# EAGLE schematic sweetbox (EAGLE 5.03)
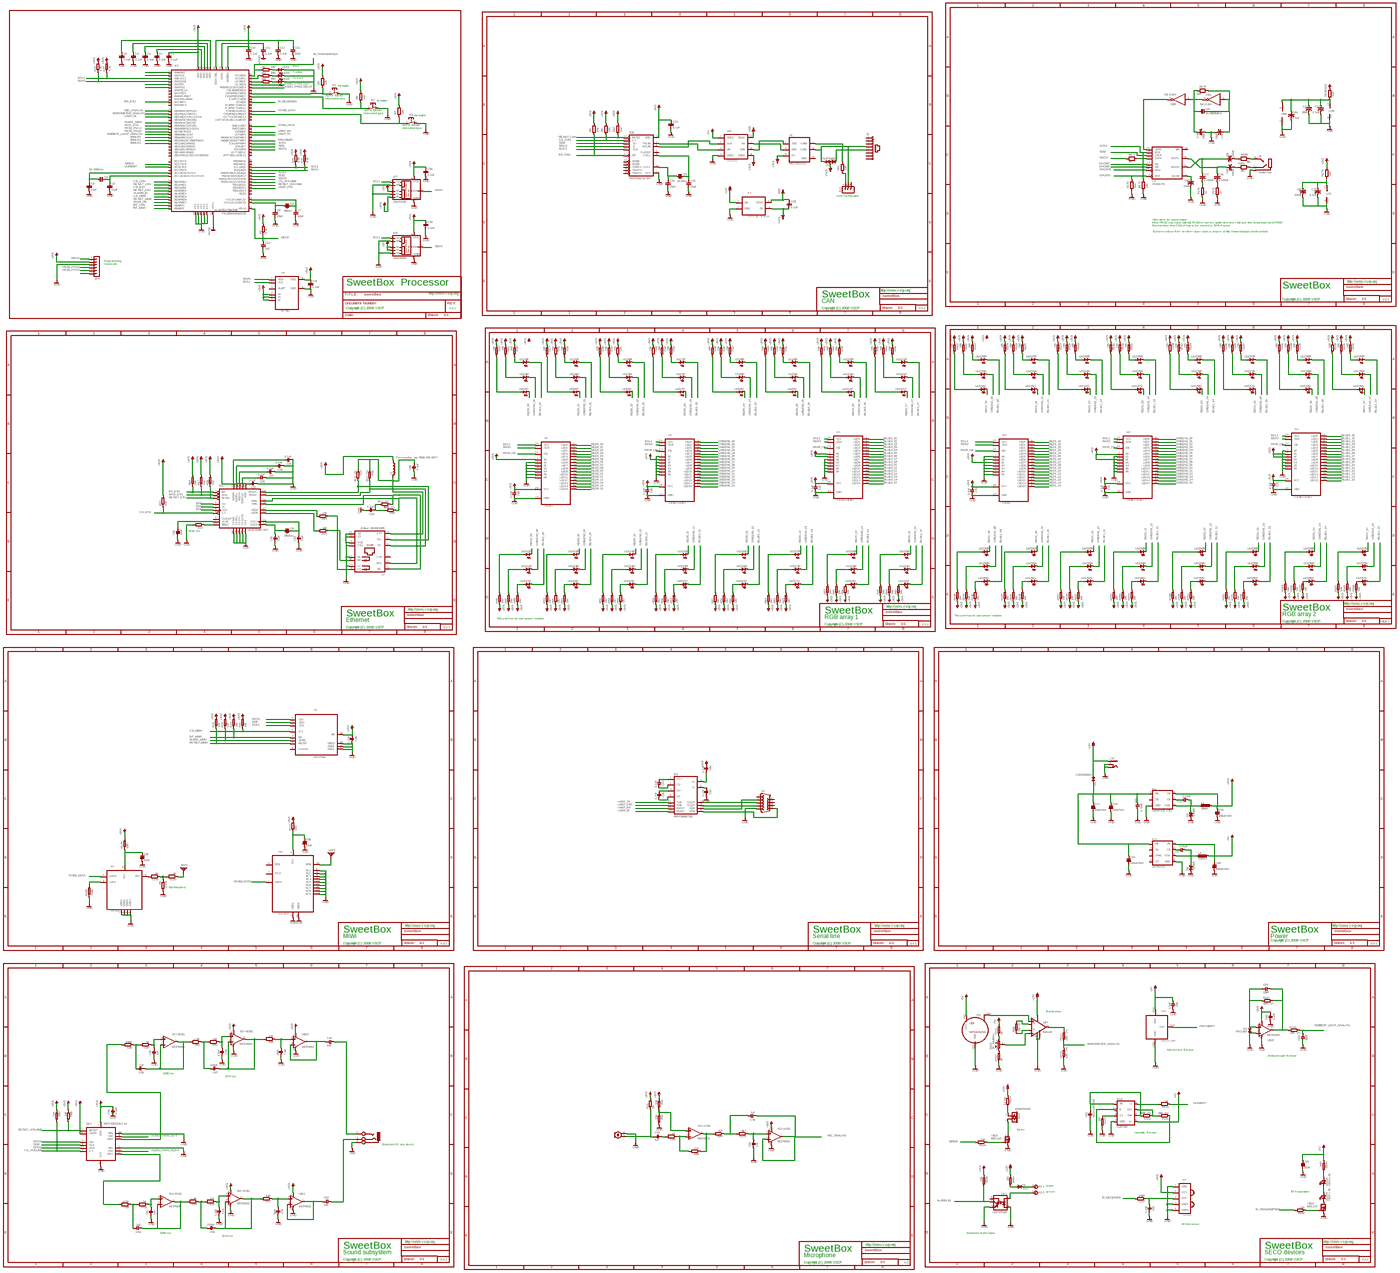
[diagram p0: schematic, sheet 1, overview]
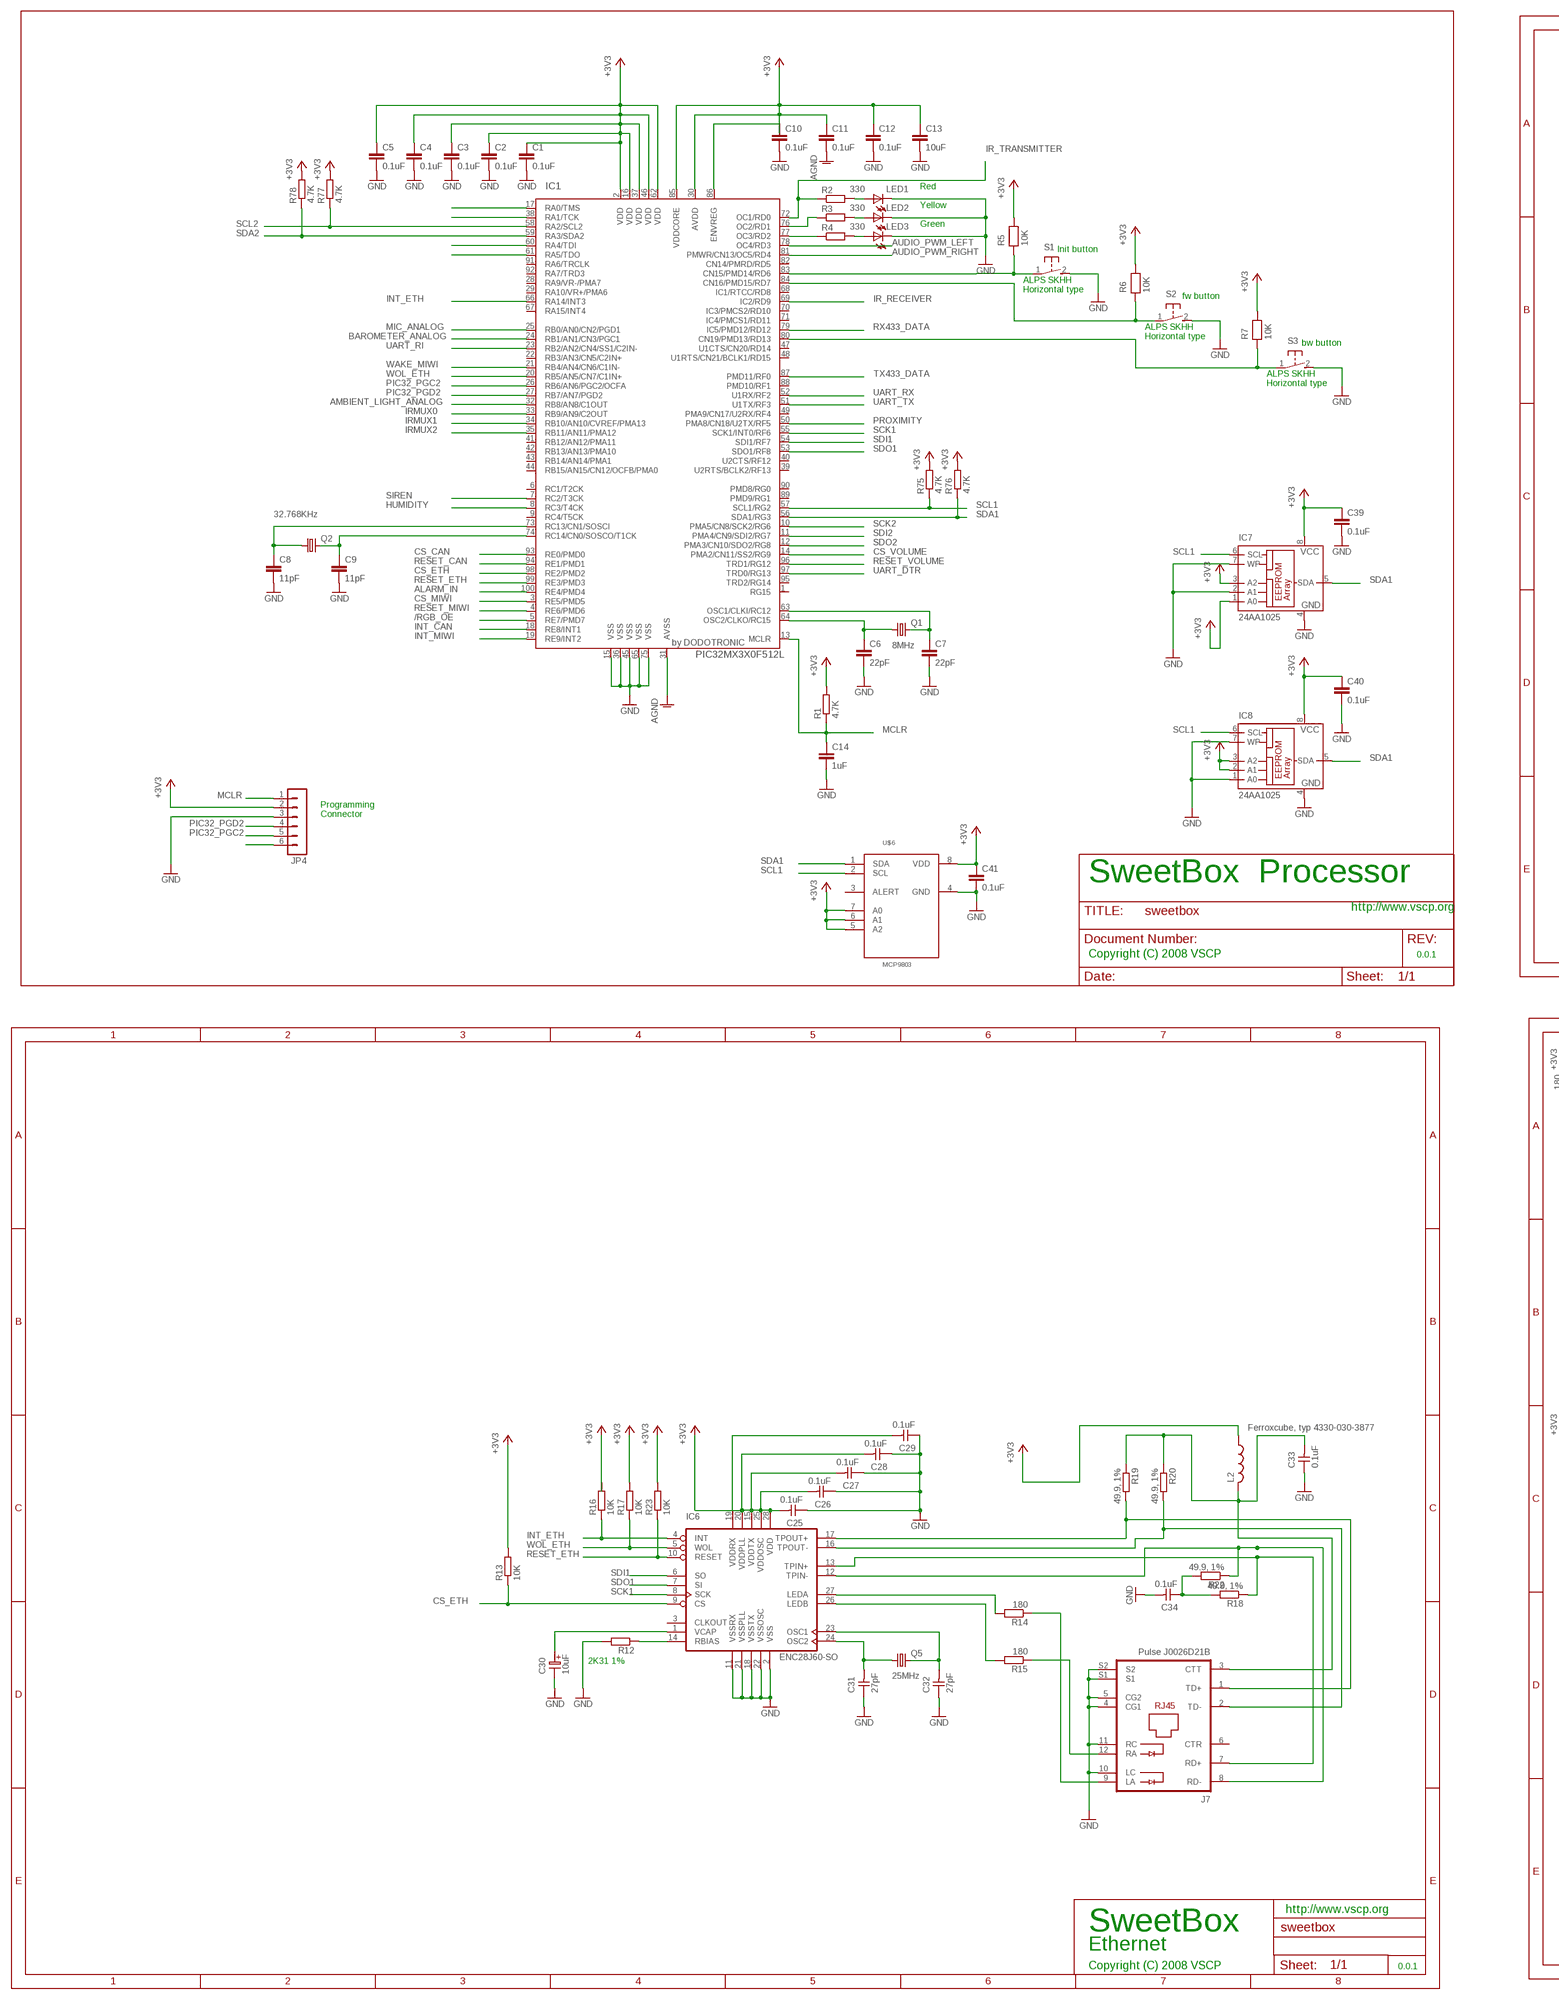
[diagram p1: schematic, sheet 1, part 1 of 6]
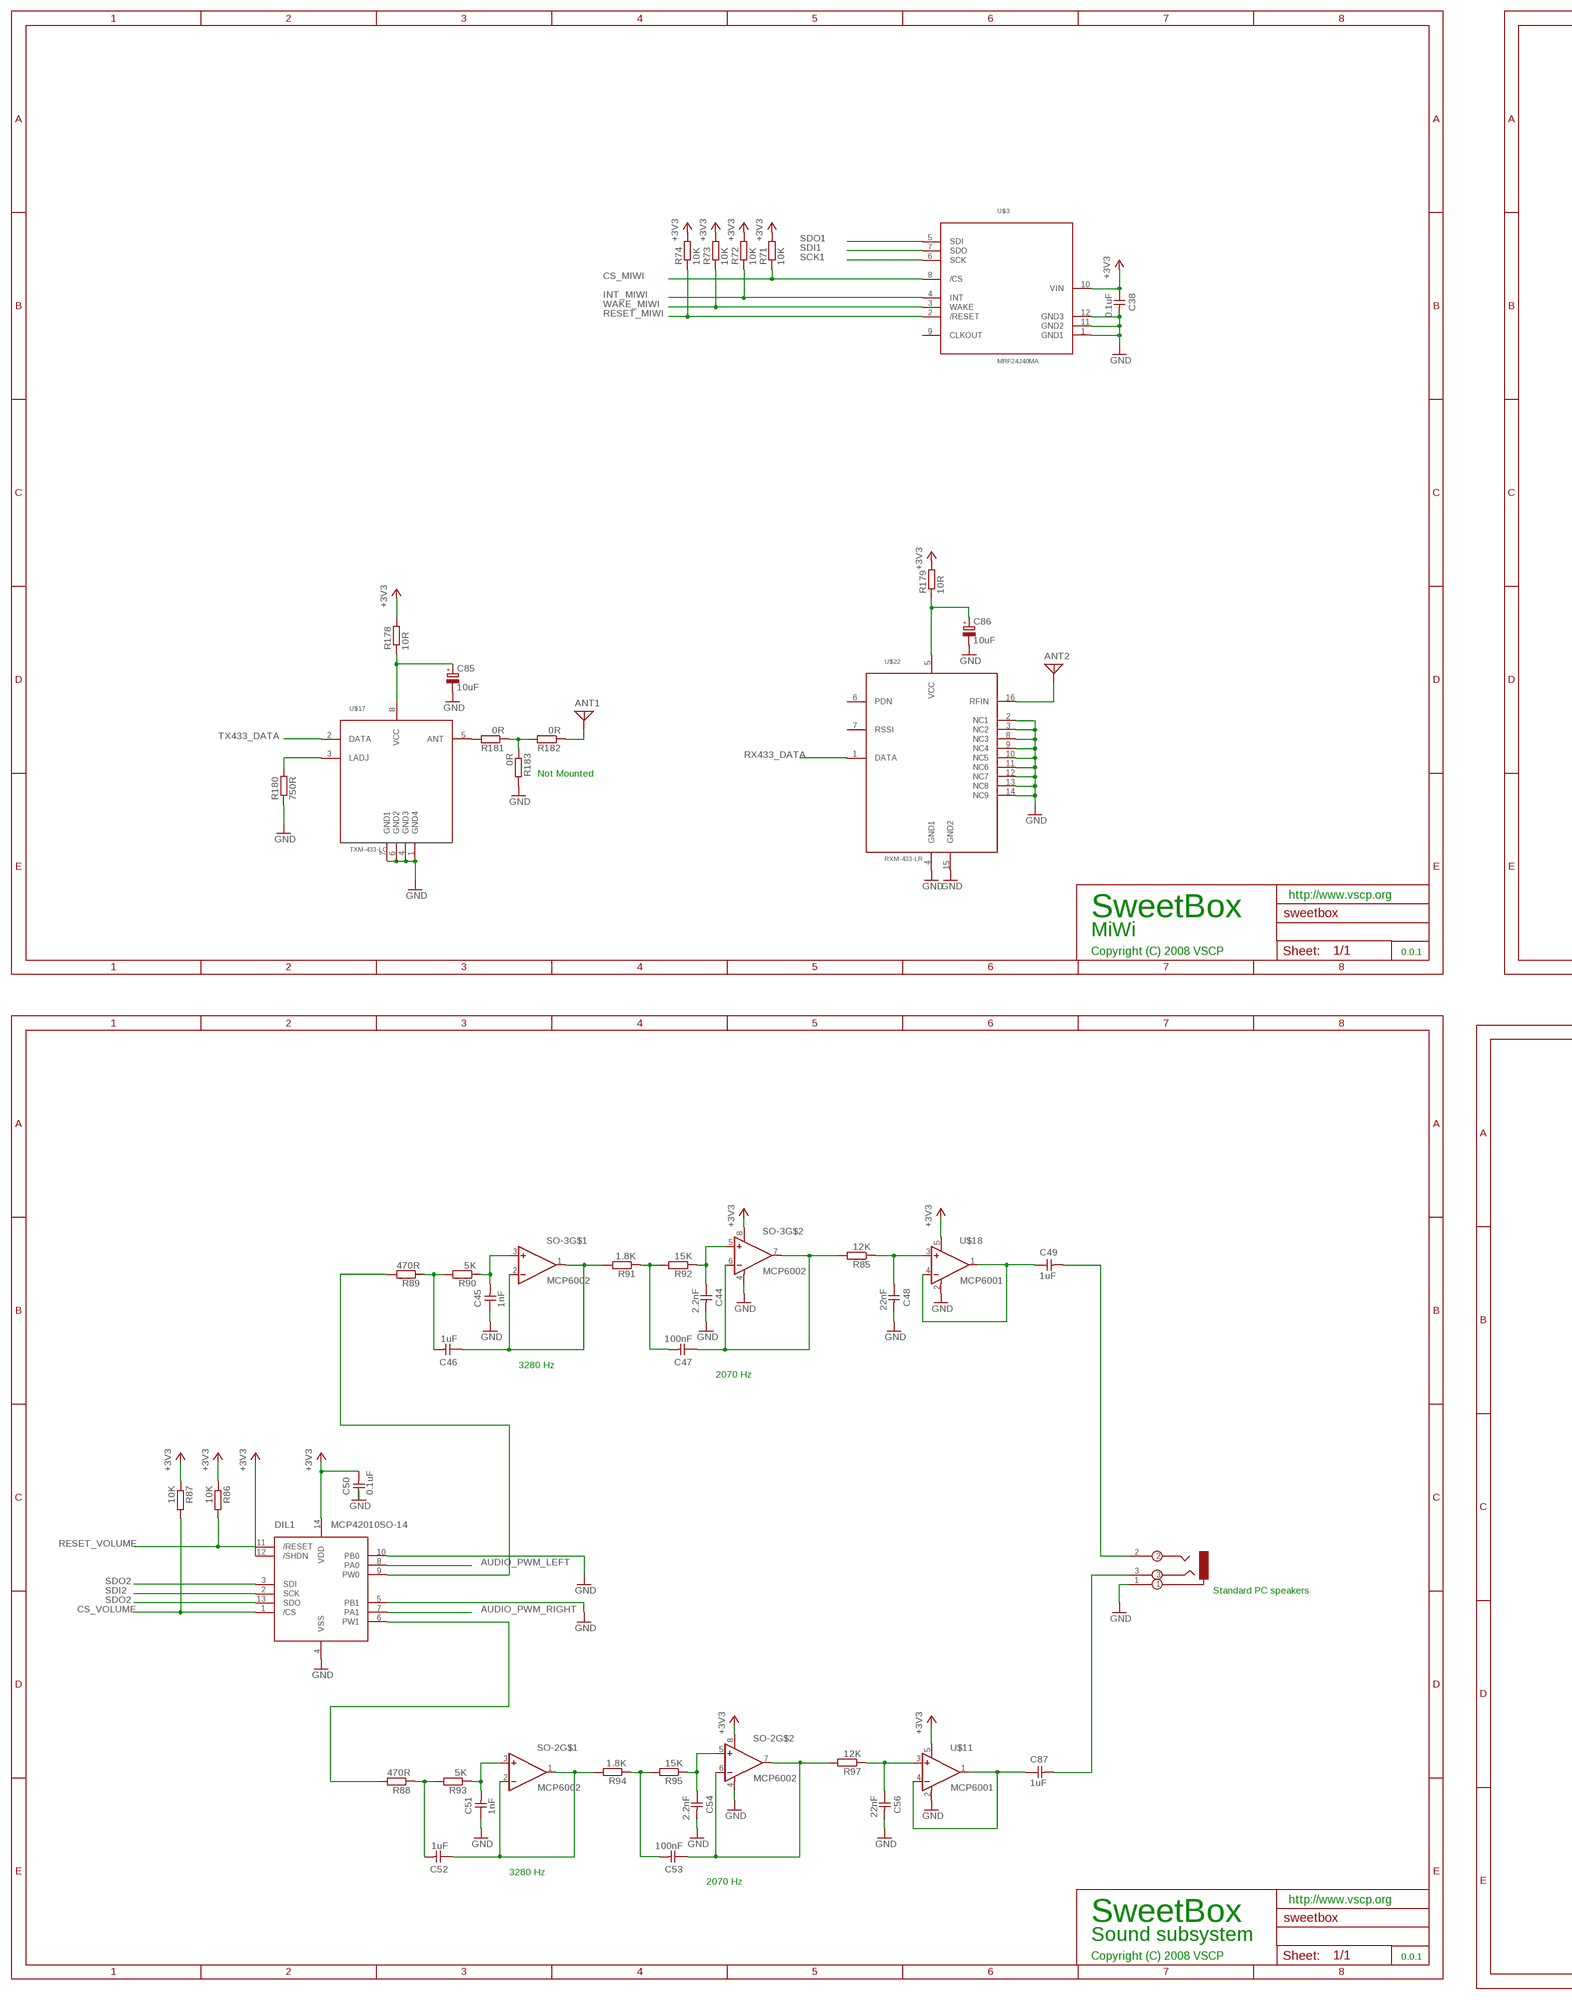
[diagram p2: schematic, sheet 1, part 2 of 6]
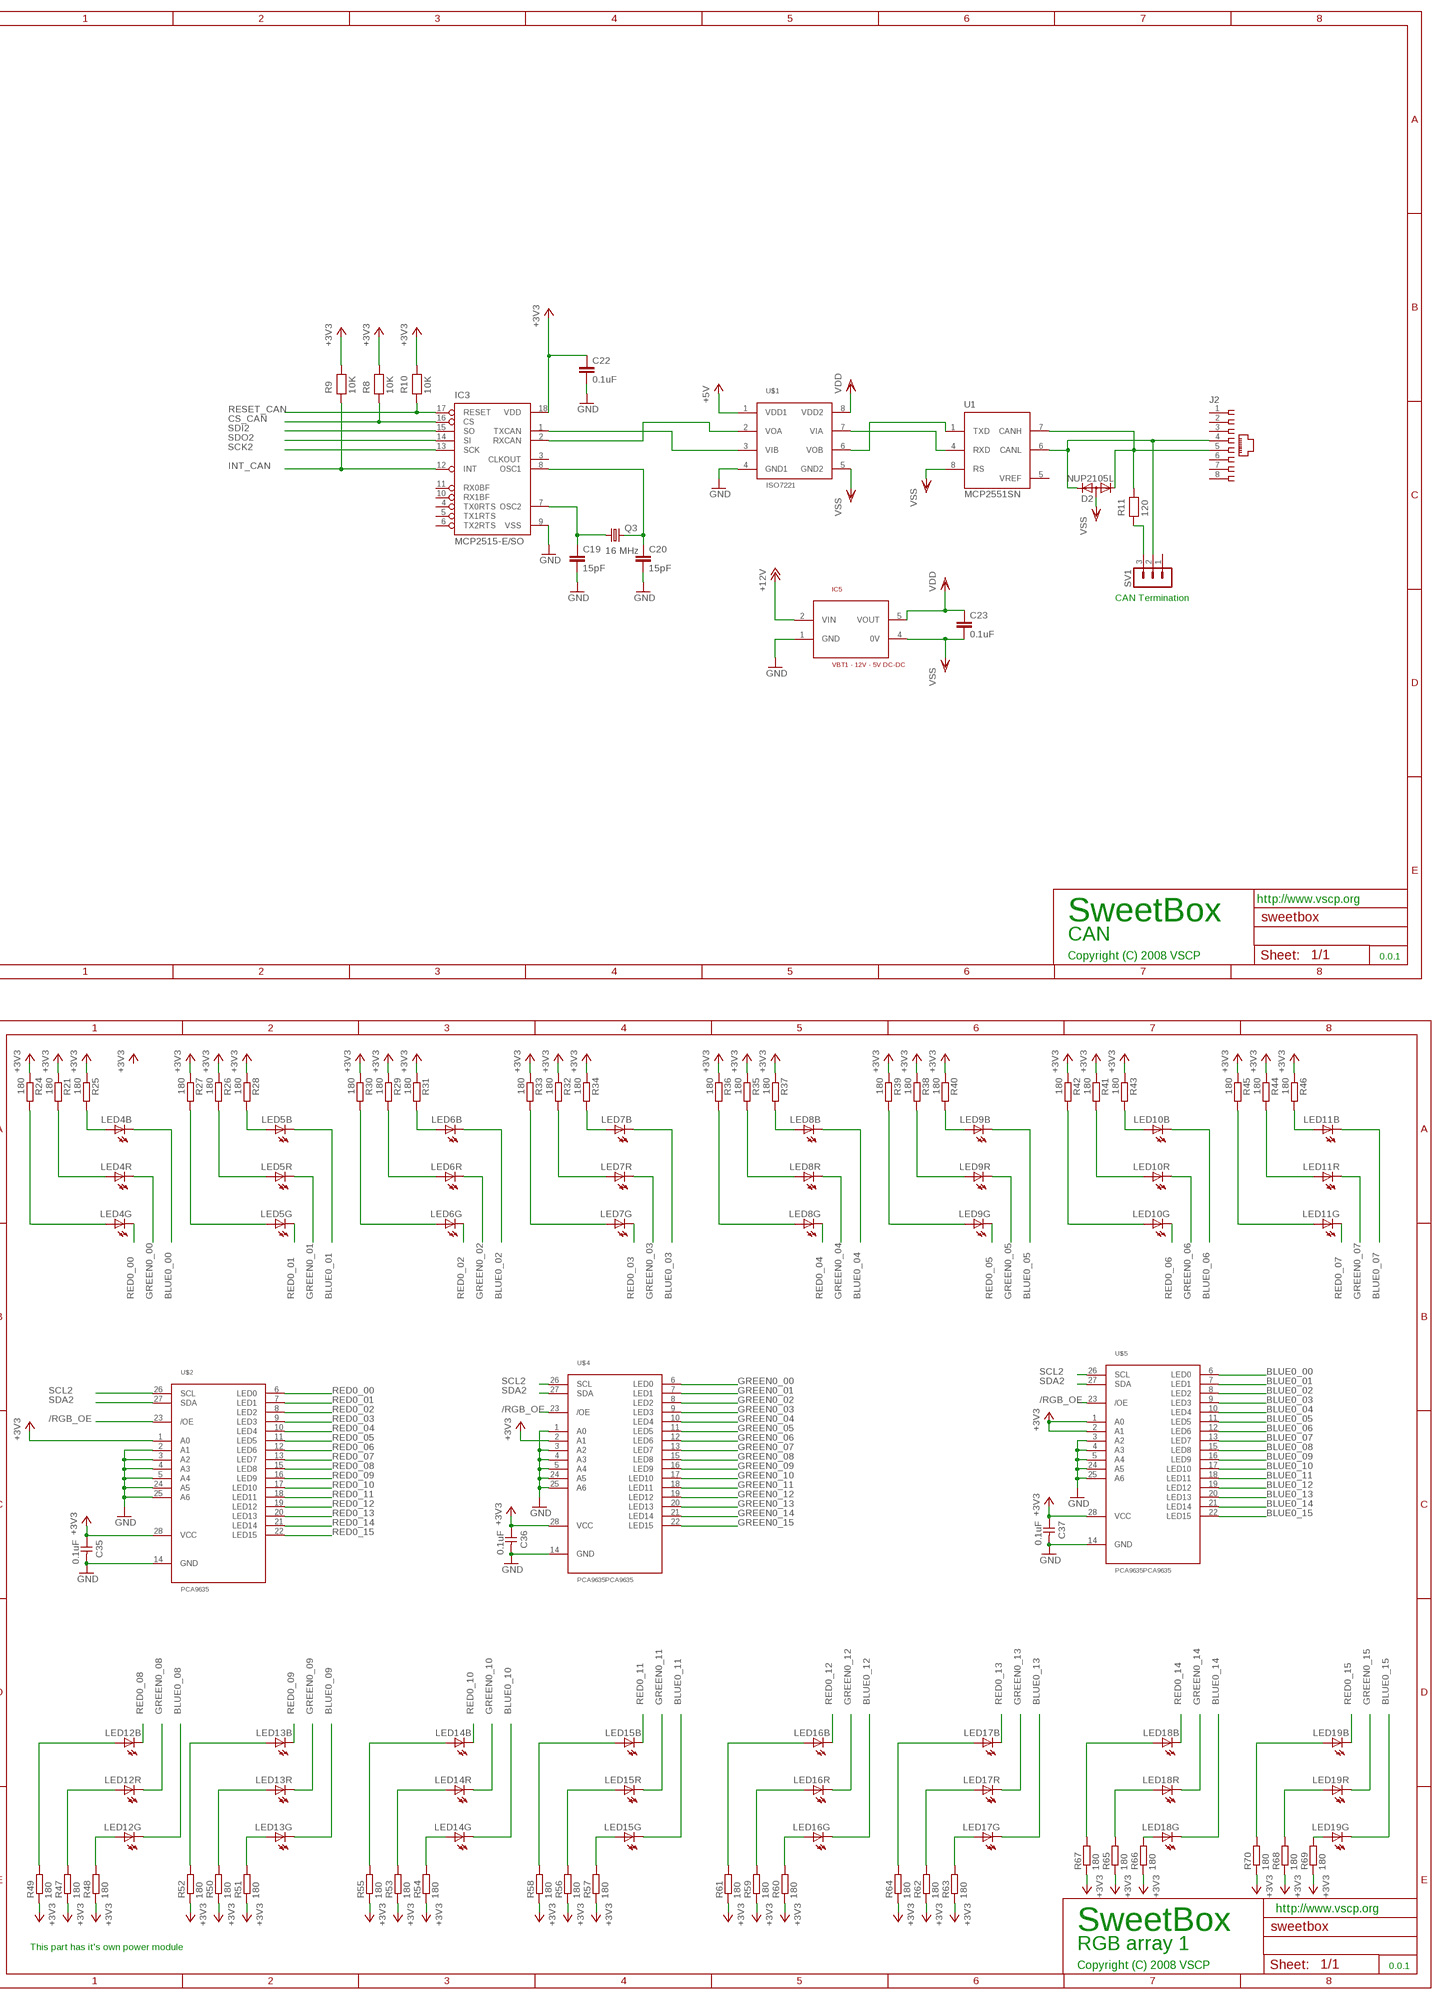
[diagram p3: schematic, sheet 1, part 3 of 6]
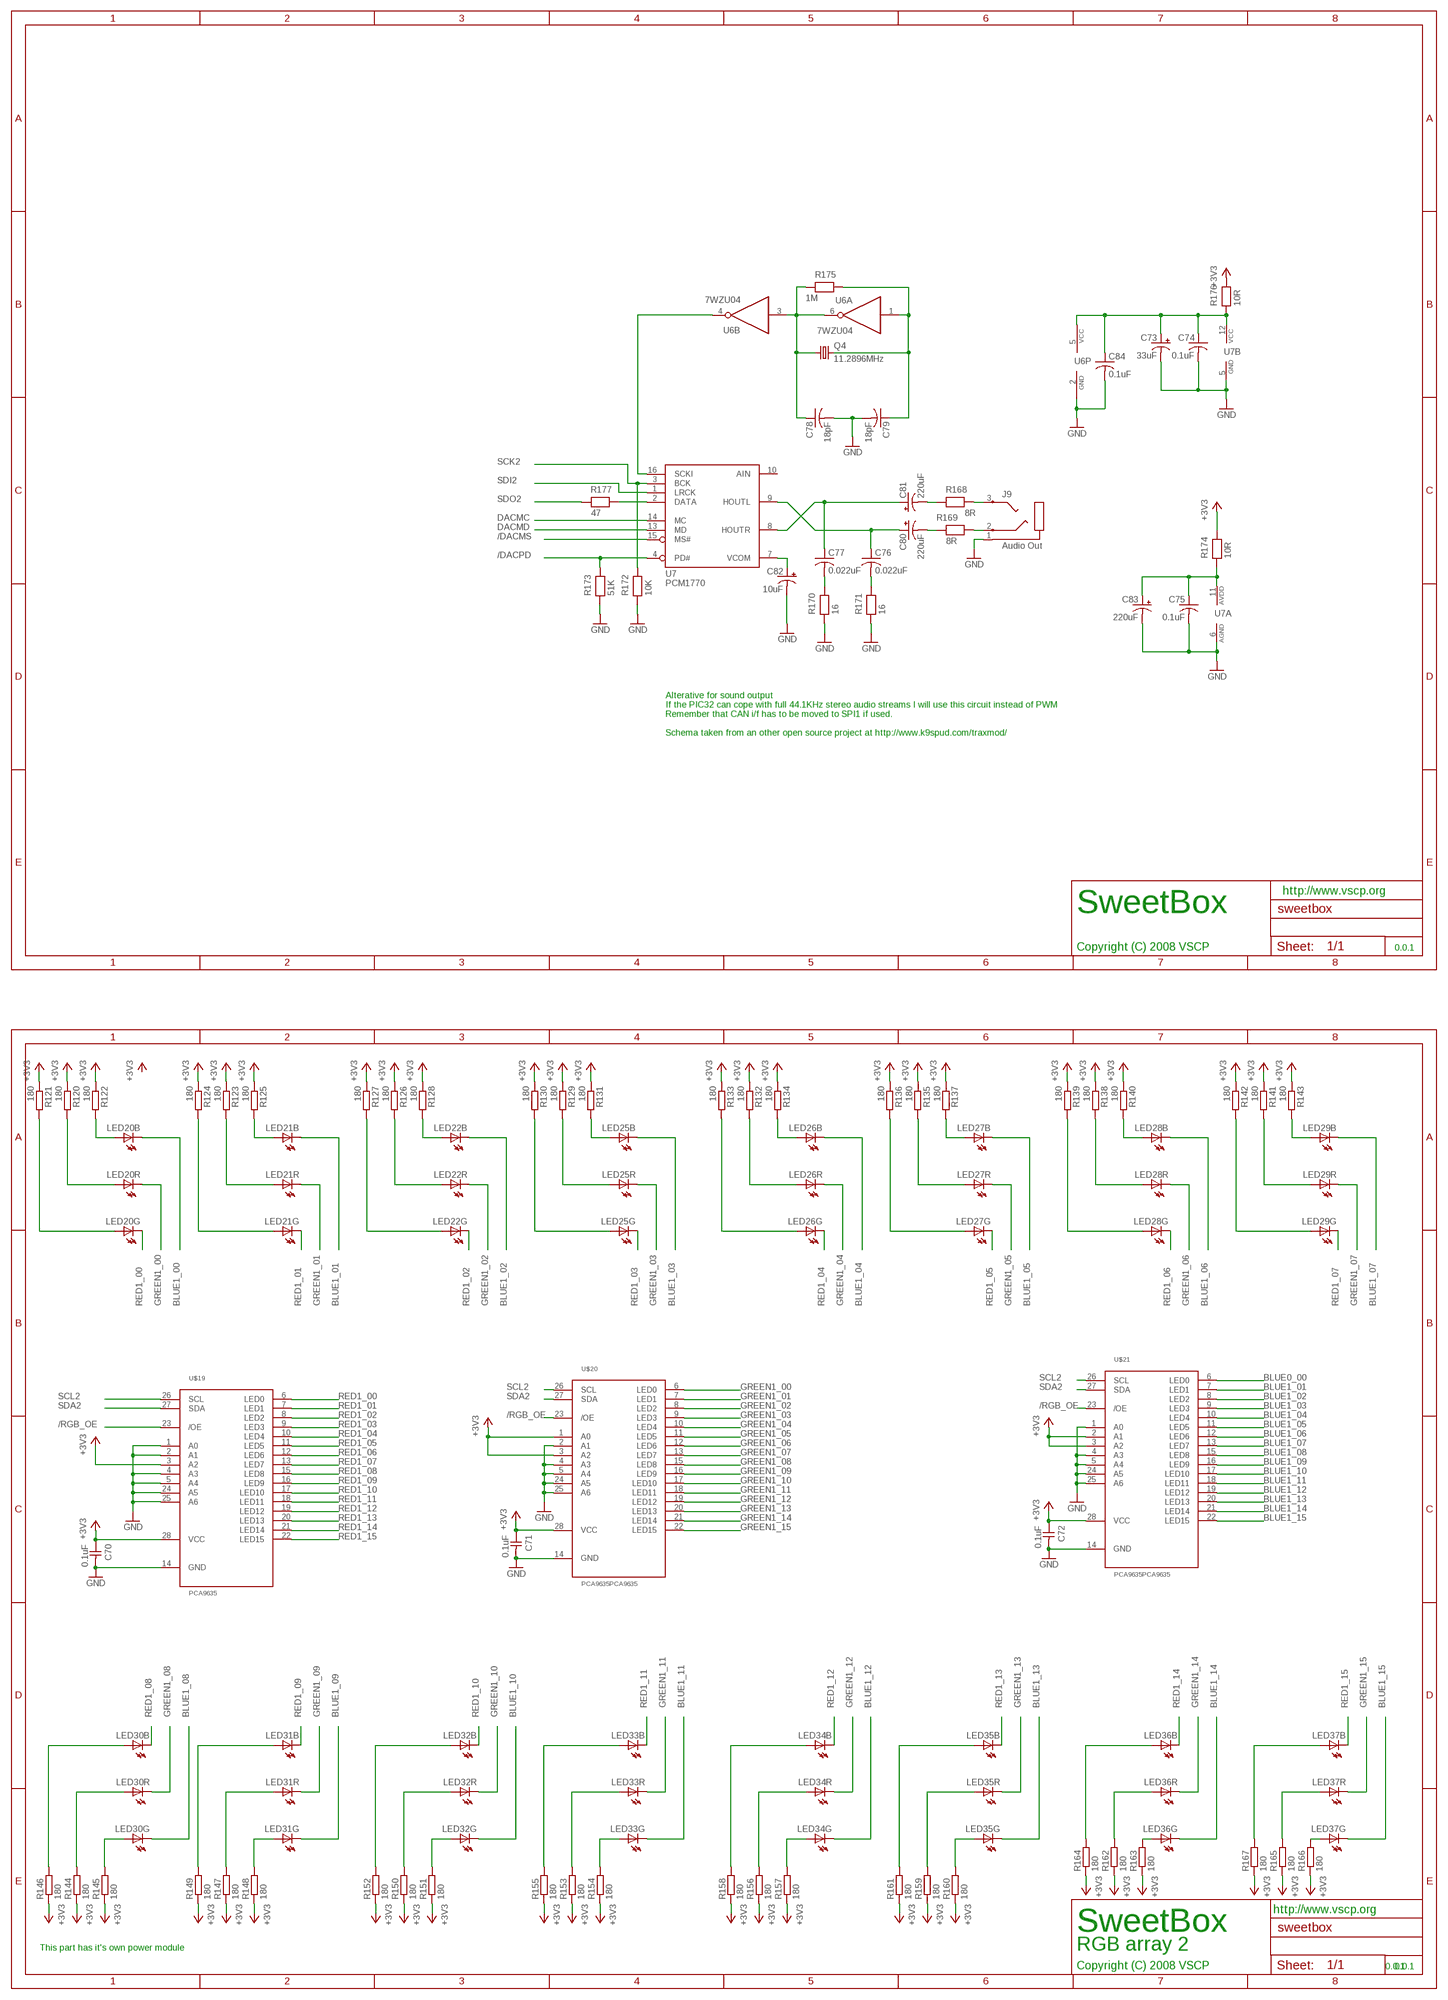
[diagram p4: schematic, sheet 1, part 4 of 6]
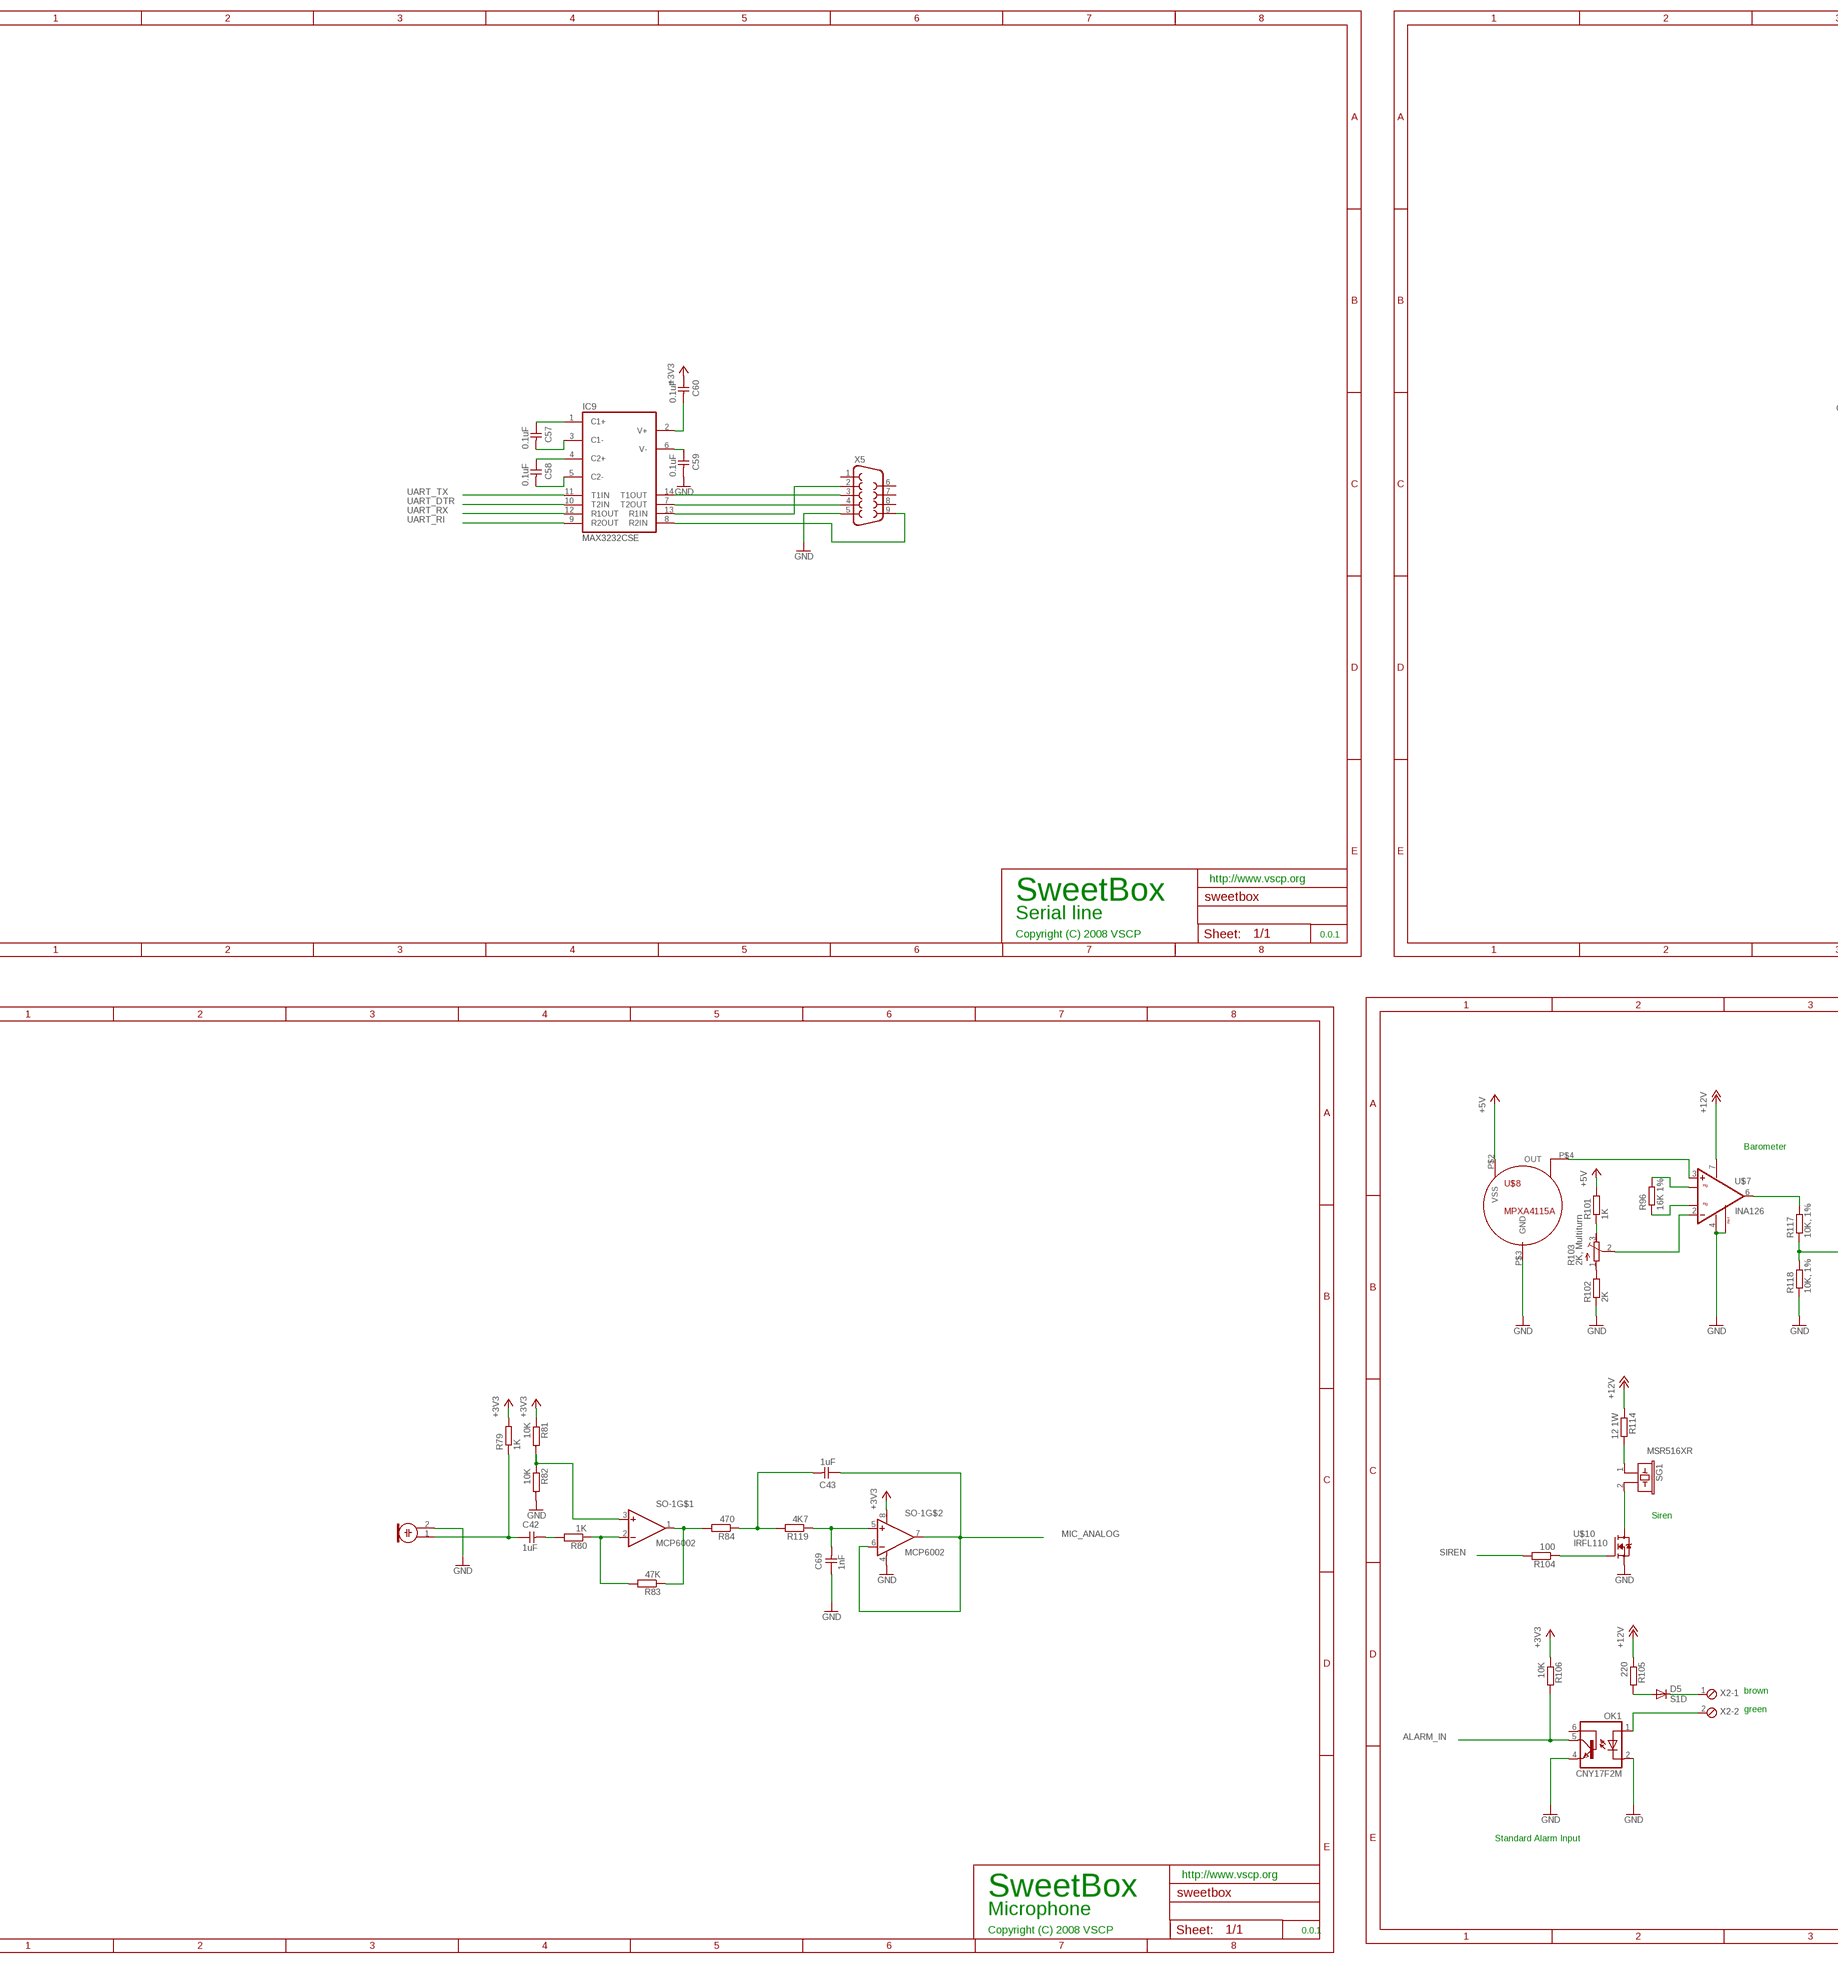
[diagram p5: schematic, sheet 1, part 5 of 6]
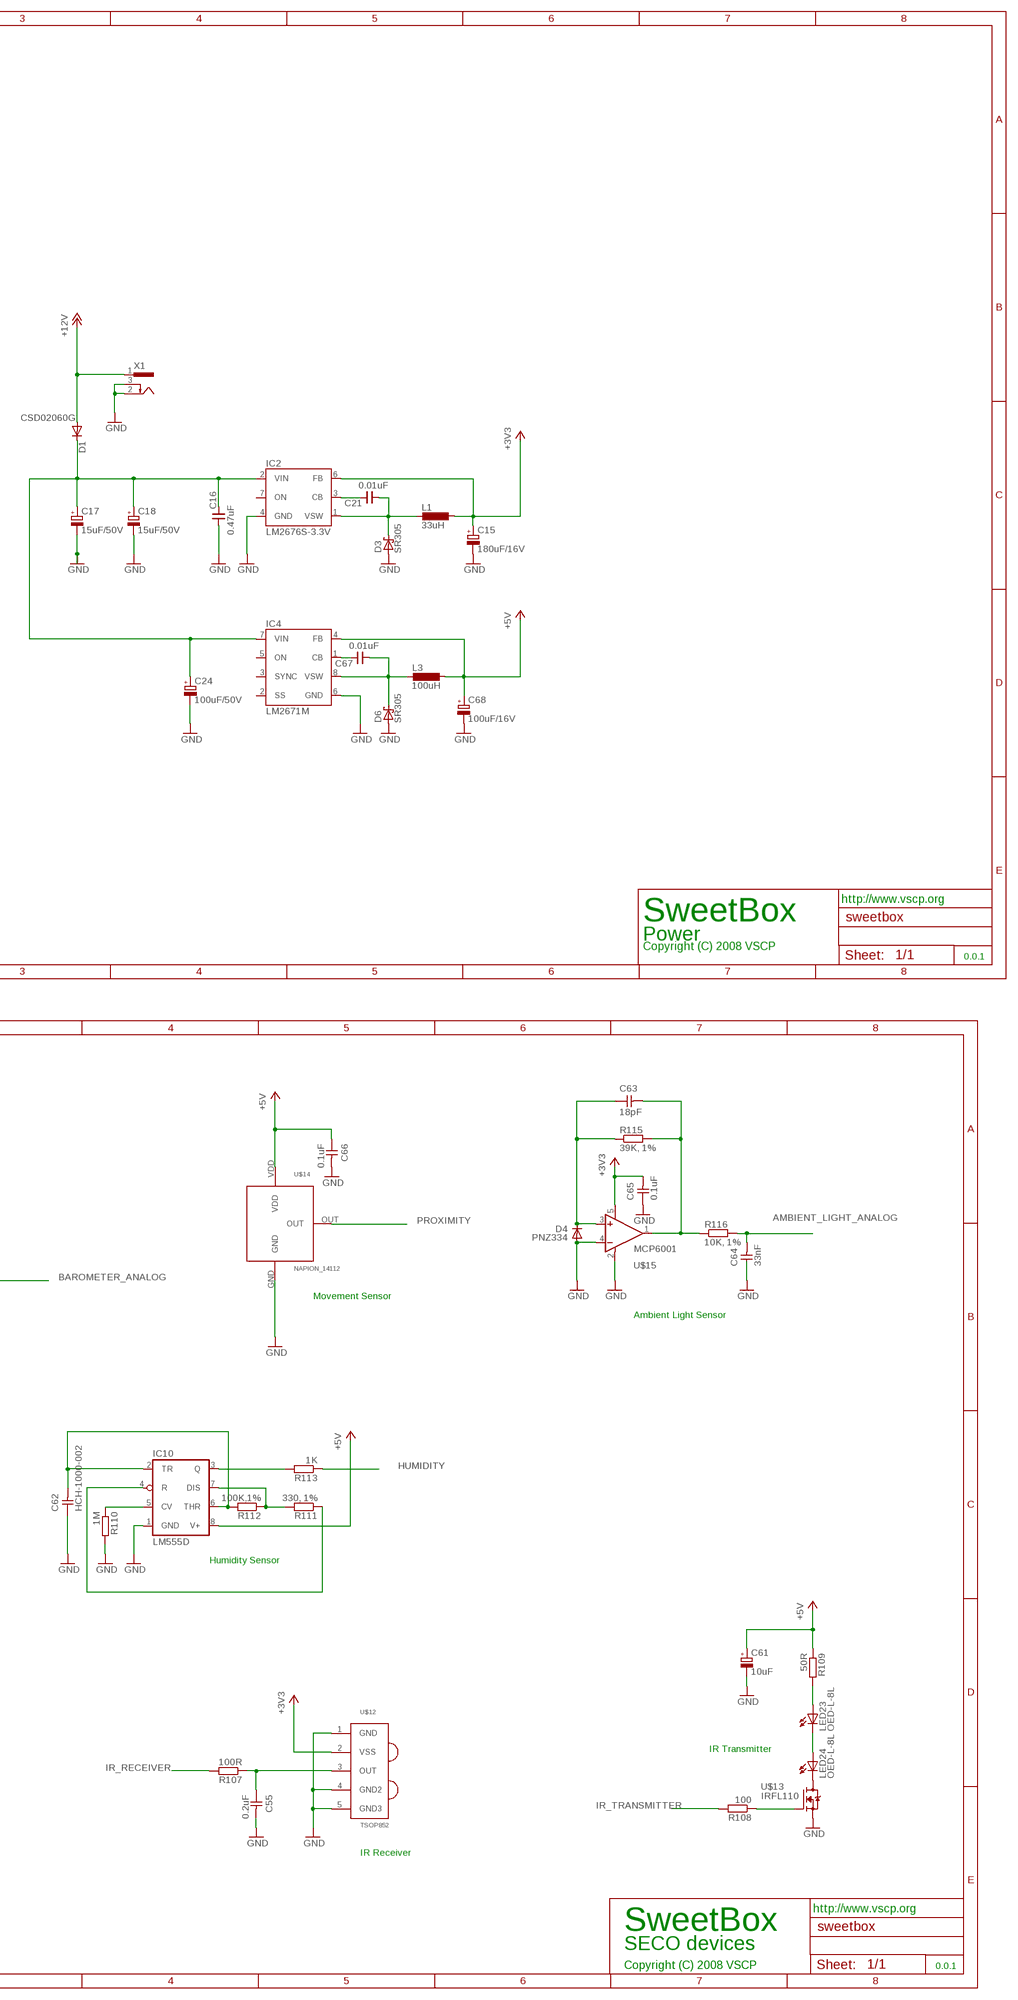
[diagram p6: schematic, sheet 1, part 6 of 6]

## Parts
ANT1  ANTENNA  [PAD-01]
ANT2  ANTENNA  [PAD-01]
C1  0.1uF  C-EUC0805  [C0805]
C2  0.1uF  C-EUC0805  [C0805]
C3  0.1uF  C-EUC0805  [C0805]
C4  0.1uF  C-EUC0805  [C0805]
C5  0.1uF  C-EUC0805  [C0805]
C6  22pF  C-EUC0805  [C0805]
C7  22pF  C-EUC0805  [C0805]
C8  11pF  C-EUC0805  [C0805]
C9  11pF  C-EUC0805  [C0805]
C10  0.1uF  C-EUC0805  [C0805]
C11  0.1uF  C-EUC0805  [C0805]
C12  0.1uF  C-EUC0805  [C0805]
C13  10uF  C-EUC0805  [C0805]
C14  1uF  C-EUC0805  [C0805]
C15  180uF/16V  CPOL-EUD  [PANASONIC_D]
C16  0.47uF  CNP-0805  [0805]
C17  15uF/50V  CPOL-EUD  [PANASONIC_D]
C18  15uF/50V  CPOL-EUD  [PANASONIC_D]
C19  15pF  C-EUC0805  [C0805]
C20  15pF  C-EUC0805  [C0805]
C21  0.01uF  CNP-0805  [0805]
C22  0.1uF  C-EUC0805  [C0805]
C23  0.1uF  C-EUC0805  [C0805]
C24  100uF/50V  CPOL-EUD  [PANASONIC_D]
C25  0.1uF  NP_CAP0805  [C0805]
C26  0.1uF  NP_CAP0805  [C0805]
C27  0.1uF  NP_CAP0805  [C0805]
C28  0.1uF  NP_CAP0805  [C0805]
C29  0.1uF  NP_CAP0805  [C0805]
C30  10uF  RSVCAP  [RSVCAP]
C31  27pF  NP_CAP0805  [C0805]
C32  27pF  NP_CAP0805  [C0805]
C33  0.1uF  NP_CAP0805  [C0805]
C34  0.1uF  NP_CAP0805  [C0805]
C35  0.1uF  NP_CAP0805  [C0805]
C36  0.1uF  NP_CAP0805  [C0805]
C37  0.1uF  NP_CAP0805  [C0805]
C38  0.1uF  NP_CAP0805  [C0805]
C39  0.1uF  C-EUC0805  [C0805]
C40  0.1uF  C-EUC0805  [C0805]
C41  0.1uF  C-EUC0805  [C0805]
C42  1uF  NP_CAP0805  [C0805]
C43  1uF  NP_CAP0805  [C0805]
C44  2.2nF  NP_CAP0805  [C0805]
C45  1nF  NP_CAP0805  [C0805]
C46  1uF  NP_CAP0805  [C0805]
C47  100nF  NP_CAP0805  [C0805]
C48  22nF  NP_CAP0805  [C0805]
C49  1uF  NP_CAP0805  [C0805]
C50  0.1uF  NP_CAP0805  [C0805]
C51  1nF  NP_CAP0805  [C0805]
C52  1uF  NP_CAP0805  [C0805]
C53  100nF  NP_CAP0805  [C0805]
C54  2.2nF  NP_CAP0805  [C0805]
C55  0.2uF  NP_CAP0805  [C0805]
C56  22nF  NP_CAP0805  [C0805]
C57  0.1uF  NP_CAP0805  [C0805]
C58  0.1uF  NP_CAP0805  [C0805]
C59  0.1uF  NP_CAP0805  [C0805]
C60  0.1uF  NP_CAP0805  [C0805]
C61  10uF  CPOL-EUD  [PANASONIC_D]
C62  HCH-1000-002  CAPNP-5  [C-5]
C63  18pF  NP_CAP0805  [C0805]
C64  33nF  NP_CAP0805  [C0805]
C65  0.1uF  NP_CAP0805  [C0805]
C66  0.1uF  NP_CAP0805  [C0805]
C67  0.01uF  CNP-0805  [0805]
C68  100uF/16V  CPOL-EUD  [PANASONIC_D]
C69  1nF  NP_CAP0805  [C0805]
C70  0.1uF  NP_CAP0805  [C0805]
C71  0.1uF  NP_CAP0805  [C0805]
C72  0.1uF  NP_CAP0805  [C0805]
C73  33uF  CPOL-USE2-5  [E2-5]
C74  0.1uF  C-USC0603  [C0603]
C75  0.1uF  C-USC0603  [C0603]
C76  0.022uF  C-USC0603  [C0603]
C77  0.022uF  C-USC0603  [C0603]
C78  18pF  C-USC0603  [C0603]
C79  18pF  C-USC0603  [C0603]
C80  220uF  CPOL-USE3.5-8  [E3,5-8]
C81  220uF  CPOL-USE3.5-8  [E3,5-8]
C82  10uF  CPOL-USE2-5  [E2-5]
C83  220uF  CPOL-USE3.5-8  [E3,5-8]
C84  0.1uF  C-USC0603  [C0603]
C85  10uF  CPOL-EUD  [PANASONIC_D]
C86  10uF  CPOL-EUD  [PANASONIC_D]
C87  1uF  NP_CAP0805  [C0805]
D1  CSD02060G  DIODE-SMB  [SMB]
D2  NUP2105L  DIODE-2CA|ACSOT23  [SOT23]
D3  SR305  SCHOTTKY-DIODEF126Z12  [F126Z12]
D4  PNZ334  1N4004  [DO41-10]
D5  S1D  DIODE-SMB  [SMB]
D6  SR305  SCHOTTKY-DIODEF126Z12  [F126Z12]
DIL1  MCP42010SO-14  [SO-14]
IC1  PIC32MX3X0F512L  [TQFP100_12X12]
IC2  LM2676S-3.3V  LM2676S  [TO263-7]
IC3  MCP2515-E/SO  [SO18L]
IC4  LM2671M  [SO08]
IC5  VBT1 - 12V - 5V DC-DC  VBT1  [VBT1]
IC6  ENC28J60-SO  [SO28W]
IC7  24AA1025  24AA128ST  [TSSOP8]
IC8  24AA1025  24AA128ST  [TSSOP8]
IC9  MAX3232CSE  [SO16]
IC10  LM555D  [SO08]
J2  520426-4  [520426-4]
J7  Pulse J0026D21B  J0026  [PJ-J0]
J9  Audio Out  3C-STEREO  [3C-3-5MM]
JP4  MA06-1  [MA06-1]
L1  33uH  DO3316P  [DO3316P]
L2  Ferroxcube, typ 4330-030-3877  L-US0207/10  [0207/10]
L3  100uH  DO3316P  [DO3316P]
LED1  LEDSMT1206  [1206]
LED2  LEDSMT1206  [1206]
LED3  LEDSMT1206  [1206]
LED4  LP2C63-ST-RGB-SR0  [LP2C63-ST-RGB-SR0]
LED5  LP2C63-ST-RGB-SR0  [LP2C63-ST-RGB-SR0]
LED6  LP2C63-ST-RGB-SR0  [LP2C63-ST-RGB-SR0]
LED7  LP2C63-ST-RGB-SR0  [LP2C63-ST-RGB-SR0]
LED8  LP2C63-ST-RGB-SR0  [LP2C63-ST-RGB-SR0]
LED9  LP2C63-ST-RGB-SR0  [LP2C63-ST-RGB-SR0]
LED10  LP2C63-ST-RGB-SR0  [LP2C63-ST-RGB-SR0]
LED11  LP2C63-ST-RGB-SR0  [LP2C63-ST-RGB-SR0]
LED12  LP2C63-ST-RGB-SR0  [LP2C63-ST-RGB-SR0]
LED13  LP2C63-ST-RGB-SR0  [LP2C63-ST-RGB-SR0]
LED14  LP2C63-ST-RGB-SR0  [LP2C63-ST-RGB-SR0]
LED15  LP2C63-ST-RGB-SR0  [LP2C63-ST-RGB-SR0]
LED16  LP2C63-ST-RGB-SR0  [LP2C63-ST-RGB-SR0]
LED17  LP2C63-ST-RGB-SR0  [LP2C63-ST-RGB-SR0]
LED18  LP2C63-ST-RGB-SR0  [LP2C63-ST-RGB-SR0]
LED19  LP2C63-ST-RGB-SR0  [LP2C63-ST-RGB-SR0]
LED20  LP2C63-ST-RGB-SR0  [LP2C63-ST-RGB-SR0]
LED21  LP2C63-ST-RGB-SR0  [LP2C63-ST-RGB-SR0]
LED22  LP2C63-ST-RGB-SR0  [LP2C63-ST-RGB-SR0]
LED23  OED-L-8L  LED3MM  [LED3MM]
LED24  OED-L-8L  LED3MM  [LED3MM]
LED25  LP2C63-ST-RGB-SR0  [LP2C63-ST-RGB-SR0]
LED26  LP2C63-ST-RGB-SR0  [LP2C63-ST-RGB-SR0]
LED27  LP2C63-ST-RGB-SR0  [LP2C63-ST-RGB-SR0]
LED28  LP2C63-ST-RGB-SR0  [LP2C63-ST-RGB-SR0]
LED29  LP2C63-ST-RGB-SR0  [LP2C63-ST-RGB-SR0]
LED30  LP2C63-ST-RGB-SR0  [LP2C63-ST-RGB-SR0]
LED31  LP2C63-ST-RGB-SR0  [LP2C63-ST-RGB-SR0]
LED32  LP2C63-ST-RGB-SR0  [LP2C63-ST-RGB-SR0]
LED33  LP2C63-ST-RGB-SR0  [LP2C63-ST-RGB-SR0]
LED34  LP2C63-ST-RGB-SR0  [LP2C63-ST-RGB-SR0]
LED35  LP2C63-ST-RGB-SR0  [LP2C63-ST-RGB-SR0]
LED36  LP2C63-ST-RGB-SR0  [LP2C63-ST-RGB-SR0]
LED37  LP2C63-ST-RGB-SR0  [LP2C63-ST-RGB-SR0]
M1  ELECTRET_MICROPHON-WM.64PN  [WM-64PN]
OK1  CNY17F2M  4N25SM  [DIL6-SMD]
Q1  8MHz  CRYSTALHC49UP  [HC49UP]
Q2  32.768KHz  CRYSTALHC49UP  [HC49UP]
Q3  16 MHz  CRYSTALHC49UP  [HC49UP]
Q4  11.2896MHz  CRYTALTC26H  [TC26H]
Q5  25MHz  CRYSTALHC49UP  [HC49UP]
R1  4.7K  R-EU_M0805  [M0805]
R2  330  R-EU_R0805  [R0805]
R3  330  R-EU_R0805  [R0805]
R4  330  R-EU_R0805  [R0805]
R5  10K  RESEU-10  [R-10]
R6  10K  RESEU-10  [R-10]
R7  10K  RESEU-10  [R-10]
R8  10K  RESEU-10  [R-10]
R9  10K  RESEU-10  [R-10]
R10  10K  RESEU-10  [R-10]
R11  120  RESEU-10  [R-10]
R12  2K31 1%  R-EU_M0805  [M0805]
R13  10K  R-EU_M0805  [M0805]
R14  180  R-EU_M0805  [M0805]
R15  180  R-EU_M0805  [M0805]
R16  10K  R-EU_M0805  [M0805]
R17  10K  R-EU_M0805  [M0805]
R18  49.9, 1%  R-EU_M0805  [M0805]
R19  49.9, 1%  R-EU_M0805  [M0805]
R20  49.9, 1%  R-EU_M0805  [M0805]
R21  180  R-EU_M0805  [M0805]
R22  49.9, 1%  R-EU_M0805  [M0805]
R23  10K  R-EU_M0805  [M0805]
R24  180  R-EU_M0805  [M0805]
R25  180  R-EU_M0805  [M0805]
R26  180  R-EU_M0805  [M0805]
R27  180  R-EU_M0805  [M0805]
R28  180  R-EU_M0805  [M0805]
R29  180  R-EU_M0805  [M0805]
R30  180  R-EU_M0805  [M0805]
R31  180  R-EU_M0805  [M0805]
R32  180  R-EU_M0805  [M0805]
R33  180  R-EU_M0805  [M0805]
R34  180  R-EU_M0805  [M0805]
R35  180  R-EU_M0805  [M0805]
R36  180  R-EU_M0805  [M0805]
R37  180  R-EU_M0805  [M0805]
R38  180  R-EU_M0805  [M0805]
R39  180  R-EU_M0805  [M0805]
R40  180  R-EU_M0805  [M0805]
R41  180  R-EU_M0805  [M0805]
R42  180  R-EU_M0805  [M0805]
R43  180  R-EU_M0805  [M0805]
R44  180  R-EU_M0805  [M0805]
R45  180  R-EU_M0805  [M0805]
R46  180  R-EU_M0805  [M0805]
R47  180  R-EU_M0805  [M0805]
R48  180  R-EU_M0805  [M0805]
R49  180  R-EU_M0805  [M0805]
R50  180  R-EU_M0805  [M0805]
R51  180  R-EU_M0805  [M0805]
R52  180  R-EU_M0805  [M0805]
R53  180  R-EU_M0805  [M0805]
R54  180  R-EU_M0805  [M0805]
R55  180  R-EU_M0805  [M0805]
R56  180  R-EU_M0805  [M0805]
R57  180  R-EU_M0805  [M0805]
R58  180  R-EU_M0805  [M0805]
R59  180  R-EU_M0805  [M0805]
R60  180  R-EU_M0805  [M0805]
R61  180  R-EU_M0805  [M0805]
R62  180  R-EU_M0805  [M0805]
R63  180  R-EU_M0805  [M0805]
R64  180  R-EU_M0805  [M0805]
R65  180  R-EU_M0805  [M0805]
R66  180  R-EU_M0805  [M0805]
R67  180  R-EU_M0805  [M0805]
R68  180  R-EU_M0805  [M0805]
R69  180  R-EU_M0805  [M0805]
R70  180  R-EU_M0805  [M0805]
R71  10K  R-EU_M0805  [M0805]
R72  10K  R-EU_M0805  [M0805]
R73  10K  R-EU_M0805  [M0805]
R74  10K  R-EU_M0805  [M0805]
R75  4.7K  R-EU_M0805  [M0805]
R76  4.7K  R-EU_M0805  [M0805]
R77  4.7K  R-EU_M0805  [M0805]
R78  4.7K  R-EU_M0805  [M0805]
R79  1K  R-EU_M0805  [M0805]
R80  1K  R-EU_M0805  [M0805]
R81  10K  R-EU_M0805  [M0805]
R82  10K  R-EU_M0805  [M0805]
R83  47K  R-EU_M0805  [M0805]
R84  470  R-EU_M0805  [M0805]
R85  12K  R-EU_M0805  [M0805]
R86  10K  R-EU_M0805  [M0805]
R87  10K  R-EU_M0805  [M0805]
R88  470R  R-EU_M0805  [M0805]
R89  470R  R-EU_M0805  [M0805]
R90  5K  R-EU_M0805  [M0805]
R91  1.8K  R-EU_M0805  [M0805]
R92  15K  R-EU_M0805  [M0805]
R93  5K  R-EU_M0805  [M0805]
R94  1.8K  R-EU_M0805  [M0805]
R95  15K  R-EU_M0805  [M0805]
R96  16K 1%  R-EU_M0805  [M0805]
R97  12K  R-EU_M0805  [M0805]
R101  1K  R-EU_M0805  [M0805]
R102  2K  R-EU_M0805  [M0805]
R103  2K, Multiturn  R-TRIMM4G/J  [RTRIM4G/J]
R104  100  R-EU_M0805  [M0805]
R105  220  R-EU_M0805  [M0805]
R106  10K  R-EU_M0805  [M0805]
R107  100R  R-EU_M0805  [M0805]
R108  100  R-EU_M0805  [M0805]
R109  50R  R-EU_M0805  [M0805]
R110  1M  R-EU_M0805  [M0805]
R111  330, 1%  R-EU_M0805  [M0805]
R112  100K,1%  R-EU_M0805  [M0805]
R113  1K  R-EU_M0805  [M0805]
R114  12 1W  R-EU_M0805  [M0805]
R115  39K, 1%  R-EU_M0805  [M0805]
R116  10K, 1%  R-EU_M0805  [M0805]
R117  10K, 1%  R-EU_M0805  [M0805]
R118  10K, 1%  R-EU_M0805  [M0805]
R119  4K7  R-EU_M0805  [M0805]
R120  180  R-EU_M0805  [M0805]
R121  180  R-EU_M0805  [M0805]
R122  180  R-EU_M0805  [M0805]
R123  180  R-EU_M0805  [M0805]
R124  180  R-EU_M0805  [M0805]
R125  180  R-EU_M0805  [M0805]
R126  180  R-EU_M0805  [M0805]
R127  180  R-EU_M0805  [M0805]
R128  180  R-EU_M0805  [M0805]
R129  180  R-EU_M0805  [M0805]
R130  180  R-EU_M0805  [M0805]
R131  180  R-EU_M0805  [M0805]
R132  180  R-EU_M0805  [M0805]
R133  180  R-EU_M0805  [M0805]
R134  180  R-EU_M0805  [M0805]
R135  180  R-EU_M0805  [M0805]
R136  180  R-EU_M0805  [M0805]
R137  180  R-EU_M0805  [M0805]
R138  180  R-EU_M0805  [M0805]
R139  180  R-EU_M0805  [M0805]
R140  180  R-EU_M0805  [M0805]
R141  180  R-EU_M0805  [M0805]
R142  180  R-EU_M0805  [M0805]
R143  180  R-EU_M0805  [M0805]
R144  180  R-EU_M0805  [M0805]
R145  180  R-EU_M0805  [M0805]
R146  180  R-EU_M0805  [M0805]
R147  180  R-EU_M0805  [M0805]
R148  180  R-EU_M0805  [M0805]
R149  180  R-EU_M0805  [M0805]
R150  180  R-EU_M0805  [M0805]
R151  180  R-EU_M0805  [M0805]
R152  180  R-EU_M0805  [M0805]
R153  180  R-EU_M0805  [M0805]
R154  180  R-EU_M0805  [M0805]
R155  180  R-EU_M0805  [M0805]
R156  180  R-EU_M0805  [M0805]
R157  180  R-EU_M0805  [M0805]
R158  180  R-EU_M0805  [M0805]
R159  180  R-EU_M0805  [M0805]
R160  180  R-EU_M0805  [M0805]
R161  180  R-EU_M0805  [M0805]
R162  180  R-EU_M0805  [M0805]
R163  180  R-EU_M0805  [M0805]
R164  180  R-EU_M0805  [M0805]
R165  180  R-EU_M0805  [M0805]
R166  180  R-EU_M0805  [M0805]
R167  180  R-EU_M0805  [M0805]
R168  8R  RESEU-10  [R-10]
R169  8R  RESEU-10  [R-10]
R170  16  RESEU-10  [R-10]
R171  16  RESEU-10  [R-10]
R172  10K  RESEU-10  [R-10]
R173  51K  RESEU-10  [R-10]
R174  10R  RESEU-10  [R-10]
R175  1M  RESEU-10  [R-10]
R176  10R  RESEU-10  [R-10]
R177  47  RESEU-10  [R-10]
R178  10R  R-EU_M0805  [M0805]
R179  10R  R-EU_M0805  [M0805]
R180  750R  R-EU_M0805  [M0805]
R181  0R  R-EU_M0805  [M0805]
R182  0R  R-EU_M0805  [M0805]
R183  0R  R-EU_M0805  [M0805]
S1  31-XX  [B3F-31XX]
S2  31-XX  [B3F-31XX]
S3  31-XX  [B3F-31XX]
SG1  MSR516XR  B/C14S  [B/C14S]
SO-1  MCP6002  [SO-8]
SO-2  MCP6002  [SO-8]
SO-3  MCP6002  [SO-8]
SV1  MA03-1  [MA03-1]
U1  MCP2551SN  [SO-08]
U6  7WZU04  NC7WZU04  [SC70-6]
U7  PCM1770  [SSOP16]
U$1  ISO7221  ADUM1201  [ADUM120]
U$2  PCA9635  PCA9635PCA9635  [TSSOP28]
U$3  MRF24J40MA  [MRF24J40MA]
U$4  PCA9635PCA9635  [TSSOP28]
U$5  PCA9635PCA9635  [TSSOP28]
U$6  MCP9803  [SOIC-8]
U$7  INA126  INA155A  [SO08]
U$8  MPXA4115A  [482-01]
U$9  SJ3523SMT  [SJ-3523-SMT]
U$10  IRFL110  [SOT223]
U$11  MCP6001  [SOT23-5L]
U$12  TSOP852  [TSOP852]
U$13  IRFL110  [SOT223]
U$14  NAPION_14112  [TYPE4]
U$15  MCP6001  [SOT23-5L]
U$17  TXM-433-LC  [TX-SMD]
U$18  MCP6001  [SOT23-5L]
U$19  PCA9635  PCA9635PCA9635  [TSSOP28]
U$20  PCA9635PCA9635  [TSSOP28]
U$21  PCA9635PCA9635  [TSSOP28]
U$22  RXM-433-LR  [SMD1]
X1  733989-5  [733989-5]
X2  MPT2  [2POL254]
X5  F09HP  [F09HP]

## Nets
+3V3: C1.1 C2.1 C3.1 C4.1 C5.1 C11.1 C12.1 C13.1 C15.+ C22.1 C25.2 C26.2 C27.2 C28.2 C29.2 C35.1 C36.1 C37.1 C38.1 C39.1 C40.1 C41.1 C60.1 C65.2 C70.1 C71.1 C72.1 DIL1.12(/SHDN) IC1.2(VDD) IC1.16(VDD) IC1.30(AVDD) IC1.37(VDD) IC1.46(VDD) IC1.62(VDD) IC1.85(VDDCORE) IC2.6(FB) IC3.18(VDD) IC6.15(VDDTX) IC6.19(VDDRX) IC6.20(VDDPLL) IC6.25(VDDOSC) IC6.28(VDD) IC7.1(A0) IC7.3(A2) IC7.8(VCC) IC8.2(A1) IC8.3(A2) IC8.8(VCC) JP4.2 L1.2 L2.1 R1.2 R5.2 R6.2 R7.2 R8.2 R9.2 R10.2 R13.2 R17.2 R21.1 R23.2 R24.1 R25.1 R26.1 R27.1 R28.1 R29.1 R30.1 R31.1 R32.1 R33.1 R34.1 R35.1 R36.1 R37.1 R38.1 R39.1 R40.1 R41.1 R42.1 R43.1 R44.1 R45.1 R46.1 R47.1 R48.1 R49.1 R50.1 R51.1 R52.1 R53.1 R54.1 R55.1 R56.1 R57.1 R58.1 R59.1 R60.1 R61.1 R62.1 R63.1 R64.1 R65.1 R66.1 R67.1 R68.1 R69.1 R70.1 R71.2 R72.2 R73.2 R74.2 R75.2 R76.2 R77.2 R78.2 R79.2 R81.1 R86.1 R87.1 R106.1 R120.1 R121.1 R122.1 R123.1 R124.1 R125.1 R126.1 R127.1 R128.1 R129.1 R130.1 R131.1 R132.1 R133.1 R134.1 R135.1 R136.1 R137.1 R138.1 R139.1 R140.1 R141.1 R142.1 R143.1 R144.1 R145.1 R146.1 R147.1 R148.1 R149.1 R150.1 R151.1 R152.1 R153.1 R154.1 R155.1 R156.1 R157.1 R158.1 R159.1 R160.1 R161.1 R162.1 R163.1 R164.1 R165.1 R166.1 R167.1 R174.2 R176.2 R178.2 R179.2 SO-1.8(V+) SO-2.8(V+) SO-3.8(V+) U$2.1(A0) U$2.28(VCC) U$3.10(VIN) U$4.2(A1) U$4.28(VCC) U$5.1(A0) U$5.2(A1) U$5.28(VCC) U$6.5(A2) U$6.6(A1) U$6.7(A0) U$6.8(VDD) U$11.5(V+) U$12.2(VSS) U$15.5(V+) U$18.5(V+) U$19.3(A2) U$19.28(VCC) U$20.1(A0) U$20.3(A2) U$20.28(VCC) U$21.2(A1) U$21.3(A2) U$21.28(VCC)
+5V: C61.+ C66.1 C68.+ IC4.4(FB) IC10.8(V+) L3.2 R101.2 R109.1 U$1.1(VDD1) U$8.P$2(VSS) U$14.VDD
+12V: D1.A IC5.2(VIN) R105.1 R114.1 U$7.7(V+) X1.1
/DACMS: U7.15(MS#)
/DACPD: R173.2 U7.4(PD#)
/RGB_OE: IC1.5(RE7/PMD7) U$2.23(/OE) U$4.23(/OE) U$5.23(/OE) U$19.23(/OE) U$20.23(/OE) U$21.23(/OE)
AGND: C11.2 IC1.31(AVSS)
ALARM_IN: IC1.100(RE4/PMD4) OK1.5(COL) R106.2
AMBIENT_LIGHT_ANALOG: C64.2 IC1.32(RB8/AN8/C1OUT) R116.2
AUDIO_LEFT: DIL1.9(PW0) R89.2
AUDIO_PWM_LEFT: DIL1.8(PA0) IC1.78(OC4/RD3)
AUDIO_PWM_RIGHT: DIL1.7(PA1) IC1.81(PMWR/CN13/OC5/RD4)
AUDIO_RIGHT: DIL1.6(PW1) R88.2
BAROMETER_ANALOG: IC1.24(RB1/AN1/CN3/PGC1) R117.1 R118.2
BLUE0_00: U$5.6(LED0) U$21.6(LED0)
BLUE0_01: LED5.4(B:C) U$5.7(LED1)
BLUE0_02: U$5.8(LED2)
BLUE0_03: U$5.9(LED3)
BLUE0_04: U$5.10(LED4)
BLUE0_05: U$5.11(LED5)
BLUE0_06: U$5.12(LED6)
BLUE0_07: LED11.4(B:C) U$5.13(LED7)
BLUE0_08: LED12.6(G:C) U$5.15(LED8)
BLUE0_09: U$5.16(LED9)
BLUE0_10: U$5.17(LED10)
BLUE0_11: U$5.18(LED11)
BLUE0_12: U$5.19(LED12)
BLUE0_13: U$5.20(LED13)
BLUE0_14: U$5.21(LED14)
BLUE0_15: U$5.22(LED15)
BLUE1_01: LED21.4(B:C) U$21.7(LED1)
BLUE1_02: U$21.8(LED2)
BLUE1_03: U$21.9(LED3)
BLUE1_04: U$21.10(LED4)
BLUE1_05: U$21.11(LED5)
BLUE1_06: U$21.12(LED6)
BLUE1_07: LED29.4(B:C) U$21.13(LED7)
BLUE1_08: LED30.6(G:C) U$21.15(LED8)
BLUE1_09: U$21.16(LED9)
BLUE1_10: U$21.17(LED10)
BLUE1_11: U$21.18(LED11)
BLUE1_12: U$21.19(LED12)
BLUE1_13: U$21.20(LED13)
BLUE1_14: U$21.21(LED14)
BLUE1_15: U$21.22(LED15)
CANH: D2.1(K1) J2.5 R11.2 U1.7(CANH)
CANL: D2.2(K2) J2.4 SV1.2 U1.6(CANL)
CS_CAN: IC1.93(RE0/PMD0) IC3.16(CS) R8.1
CS_ETH: IC1.98(RE2/PMD2) IC6.9(CS) R13.1
CS_MIWI: IC1.3(RE5/PMD5) R71.1 U$3.8(/CS)
CS_VOLUME: DIL1.1(/CS) IC1.14(PMA2/CN11/SS2/RG9) R87.2
DACAVDD: C75.1 C83.+ R174.1 U7.11(AVDD)
DACMC: U7.14(MC)
DACMD: U7.13(MD)
DATA: R177.2 U7.2(DATA)
GND: C1.2 C2.2 C3.2 C4.2 C5.2 C6.2 C7.2 C8.2 C9.2 C10.2 C12.2 C13.2 C14.2 C15.- C16.1 C17.- C18.- C19.2 C20.2 C22.2 C24.- C25.1 C26.1 C27.1 C28.1 C29.1 C30.P$2 C31.1 C32.1 C33.1 C34.2 C35.2 C36.2 C37.2 C38.2 C39.2 C40.2 C41.2 C44.2 C45.1 C48.2 C50.1 C51.1 C54.2 C55.2 C56.2 C59.2 C61.- C62.1 C65.1 C66.2 C68.- C69.1 C70.2 C71.2 C72.2 C73.- C74.2 C75.2 C78.2 C79.2 C82.- C83.- C84.2 C85.- C86.- D3.A D4.A D6.A DIL1.4(VSS) DIL1.5(PB1) DIL1.10(PB0) IC2.4(GND) IC3.9(VSS) IC4.6(GND) IC5.1(GND) IC6.2(VSS) IC6.11(VSSRX) IC6.18(VSSTX) IC6.21(VSSPLL) IC6.22(VSSOSC) IC7.2(A1) IC7.4(GND) IC7.7(WP) IC8.1(A0) IC8.4(GND) IC8.7(WP) IC10.1(GND) J7.4(CG1) J7.5(CG2) J7.10(LC) J7.11(RC) J7.S1 J7.S2 J9.1 JP4.3 LED1.C LED2.C LED3.C M1.2 OK1.2(C) OK1.4(EMI) R12.2 R82.2 R102.1 R110.2 R118.1 R170.1 R171.1 R172.1 R173.1 R180.1 R183.2 S1.2(S) S2.2(S) S3.2(S) SO-1.4(V-) SO-2.4(V-) SO-3.4(V-) U6.2(P:GND) U7.5(GND) U7.6(AGND) U$1.4(GND1) U$2.2(A1) U$2.3(A2) U$2.4(A3) U$2.5(A4) U$2.14(GND) U$2.24(A5) U$2.25(A6) U$3.1(GND1) U$3.11(GND2) U$3.12(GND3) U$4.1(A0) U$4.3(A2) U$4.4(A3) U$4.5(A4) U$4.14(GND) U$4.24(A5) U$4.25(A6) U$5.3(A2) U$5.4(A3) U$5.5(A4) U$5.14(GND) U$5.24(A5) U$5.25(A6) U$6.4(GND) U$7.4(GND) U$7.5(REF) U$8.P$3(GND) U$9.1 U$10.3(S) U$11.2(V-) U$13.3(S) U$14.GND U$15.2(V-) U$15.4(-IN) U$17.1(GND4) U$17.4(GND3) U$17.6(GND2) U$17.7(GND1) U$18.2(V-) U$19.1(A0) U$19.2(A1) U$19.4(A3) U$19.5(A4) U$19.14(GND) U$19.24(A5) U$19.25(A6) U$20.2(A1) U$20.4(A3) U$20.5(A4) U$20.14(GND) U$20.24(A5) U$20.25(A6) U$21.1(A0) U$21.4(A3) U$21.5(A4) U$21.14(GND) U$21.24(A5) U$21.25(A6) U$22.2(NC1) U$22.3(NC2) U$22.4(GND1) U$22.9(NC4) U$22.10(NC5) U$22.11(NC6) U$22.12(NC7) U$22.13(NC8) U$22.14(NC9) U$22.15(GND2) X1.2 X1.3 X5.5
GND2: U$12.1(GND) U$12.4(GND2) U$12.5(GND3) ; supply symbol labelled GND
GREEN0_00: U$4.6(LED0)
GREEN0_01: LED5.5(R:C) U$4.7(LED1)
GREEN0_02: U$4.8(LED2)
GREEN0_03: U$4.9(LED3)
GREEN0_04: U$4.10(LED4)
GREEN0_05: U$4.11(LED5)
GREEN0_06: U$4.12(LED6)
GREEN0_07: LED11.5(R:C) U$4.13(LED7)
GREEN0_08: LED12.5(R:C) U$4.15(LED8)
GREEN0_09: U$4.16(LED9)
GREEN0_10: U$4.17(LED10)
GREEN0_11: U$4.18(LED11)
GREEN0_12: U$4.19(LED12)
GREEN0_13: U$4.20(LED13)
GREEN0_14: U$4.21(LED14)
GREEN0_15: U$4.22(LED15)
GREEN1_00: U$20.6(LED0)
GREEN1_01: LED21.5(R:C) U$20.7(LED1)
GREEN1_02: U$20.8(LED2)
GREEN1_03: U$20.9(LED3)
GREEN1_04: U$20.10(LED4)
GREEN1_05: U$20.11(LED5)
GREEN1_06: U$20.12(LED6)
GREEN1_07: LED29.5(R:C) U$20.13(LED7)
GREEN1_08: LED30.5(R:C) U$20.15(LED8)
GREEN1_09: U$20.16(LED9)
GREEN1_10: U$20.17(LED10)
GREEN1_11: U$20.18(LED11)
GREEN1_12: U$20.19(LED12)
GREEN1_13: U$20.20(LED13)
GREEN1_14: U$20.21(LED14)
GREEN1_15: U$20.22(LED15)
HOUTL: C77.1 C81.+ U7.8(HOUTR)
HOUTR: C76.1 C80.+ U7.9(HOUTL)
HUMIDITY: IC1.8(RC3/T4CK) R113.1
INT_CAN: IC1.18(RE8/INT1) IC3.12(INT) R9.1
INT_ETH: IC1.66(RA14/INT3) IC6.4(INT) R16.1
INT_MIWI: IC1.19(RE9/INT2) R72.1 U$3.4(INT)
IR_RECEIVER: IC1.69(IC2/RD9) R107.2
IR_TRANSMITTER: IC1.72(OC1/RD0) R2.1 R108.2
IRMUX0: IC1.33(RB9/AN9/C2OUT)
IRMUX1: IC1.34(RB10/AN10/CVREF/PMA13)
IRMUX2: IC1.35(RB11/AN11/PMA12)
MCLK: U6.4(B:O) U7.16(SCKI)
MCLR: C14.1 IC1.13(MCLR) JP4.1 R1.1
MIC_ANALOG: C43.1 IC1.25(RB0/AN0/CN2/PGD1) SO-1.6(-IN) SO-1.7(OUT)
N$1: C8.1 IC1.73(RC13/CN1/SOSCI) Q2.1
N$2: C9.1 IC1.74(RC14/CN0/SOSCO/T1CK) Q2.2
N$3: C10.1 IC1.86(ENVREG)
N$4: C16.2 C17.+ C18.+ C24.+ D1.C IC2.2(VIN) IC4.7(VIN)
N$5: C7.1 IC1.63(OSC1/CLKI/RC12) Q1.2
N$6: C6.1 IC1.64(OSC2/CLKO/RC15) Q1.1
N$7: IC10.7(DIS) R111.2 R112.1
N$8: IC1.76(OC2/RD1) R3.1
N$9: IC1.77(OC3/RD2) R4.1
N$10: LED1.A R2.2
N$11: LED2.A R3.2
N$12: LED3.A R4.2
N$13: IC1.83(CN15/PMD14/RD6)
N$14: IC1.84(CN16/PMD15/RD7) R6.1 S2.1(P)
N$15: IC1.80(CN19/PMD13/RD13) R7.1 S3.1(P)
N$16: R5.1 S1.1(P)
N$17: IC1.17(RA0/TMS)
N$18: IC1.38(RA1/TCK)
N$19: IC1.60(RA4/TDI)
N$20: IC1.61(RA5/TDO)
N$21: U1.4(RXD) U$1.7(VIA)
N$22: U1.1(TXD) U$1.6(VOB)
N$23: C20.1 IC3.8(OSC1) Q3.2
N$24: C19.1 IC3.7(OSC2) Q3.1
N$25: R11.1 SV1.3
N$26: IC3.1(TXCAN) U$1.3(VIB)
N$27: IC3.2(RXCAN) U$1.2(VOA)
N$28: IC6.14(RBIAS) R12.1
N$29: C30.P$1 IC6.1(VCAP)
N$30: C34.1 R18.2 R22.2
N$31: C33.2 J7.3(CTT) L2.2 R19.1 R20.1
N$32: LED4.3(B:A) R25.2
N$33: LED4.2(R:A) R21.2
N$34: LED4.1(G:A) R24.2
N$35: J7.9(LA) R14.1
N$36: J7.12(RA) R15.1
N$37: LED5.3(B:A) R28.2
N$38: LED5.2(R:A) R26.2
N$39: LED5.1(G:A) R27.2
N$40: LED6.3(B:A) R31.2
N$41: LED6.2(R:A) R29.2
N$42: LED6.1(G:A) R30.2
N$43: LED7.3(B:A) R34.2
N$44: LED7.2(R:A) R32.2
N$45: LED7.1(G:A) R33.2
N$46: LED8.3(B:A) R37.2
N$47: LED8.2(R:A) R35.2
N$48: LED8.1(G:A) R36.2
N$49: LED9.3(B:A) R40.2
N$50: LED9.2(R:A) R38.2
N$51: LED9.1(G:A) R39.2
N$52: LED10.3(B:A) R43.2
N$53: C31.2 IC6.24(OSC2) Q5.1
N$54: C32.2 IC6.23(OSC1) Q5.2
N$55: LED10.2(R:A) R41.2
N$56: LED10.1(G:A) R42.2
N$57: IC6.26(LEDB) R15.2
N$58: LED11.3(B:A) R46.2
N$59: LED11.2(R:A) R44.2
N$60: LED11.1(G:A) R45.2
N$61: LED12.1(G:A) R48.2
N$62: LED12.2(R:A) R47.2
N$63: LED12.3(B:A) R49.2
N$64: LED13.1(G:A) R51.2
N$65: LED13.2(R:A) R50.2
N$66: LED13.3(B:A) R52.2
N$67: LED14.1(G:A) R54.2
N$68: LED14.2(R:A) R53.2
N$69: LED14.3(B:A) R55.2
N$70: LED15.1(G:A) R57.2
N$71: LED15.2(R:A) R56.2
N$72: LED15.3(B:A) R58.2
N$73: LED16.1(G:A) R60.2
N$74: LED16.2(R:A) R59.2
N$75: LED16.3(B:A) R61.2
N$76: LED17.1(G:A) R63.2
N$77: LED17.2(R:A) R62.2
N$78: LED17.3(B:A) R64.2
N$79: LED19.1(G:A) R69.2
N$80: LED18.2(R:A) R65.2
N$81: LED18.3(B:A) R67.2
N$82: LED18.1(G:A) R66.2
N$83: C42.2 R80.2
N$84: LED19.2(R:A) R68.2
N$85: LED19.3(B:A) R70.2
N$86: C42.1 M1.1 R79.1
N$87: LED20.3(B:A) R122.2
N$88: R81.2 R82.1 SO-1.3(+IN)
N$89: R80.1 R83.2 SO-1.2(-IN)
N$90: R83.1 R84.2 SO-1.1(OUT)
N$91: C47.2 R91.1 R92.2
N$92: C52.2 R88.1 R93.2
N$93: C47.1 R85.2 SO-3.6(-IN) SO-3.7(OUT)
N$94: C49.1 U$18.1(OUT) U$18.4(-IN)
N$95: C46.2 R89.1 R90.2
N$96: C44.1 R92.1 SO-3.5(+IN)
N$97: C46.1 R91.2 SO-3.1(OUT) SO-3.2(-IN)
N$98: C48.1 R85.1 U$18.3(+IN)
N$99: C45.2 R90.1 SO-3.3(+IN)
N$100: C49.2 U$9.2
N$101: C52.1 R94.2 SO-2.1(OUT) SO-2.2(-IN)
N$102: C53.2 R94.1 R95.2
N$103: C53.1 R97.2 SO-2.6(-IN) SO-2.7(OUT)
N$104: C57.1 IC9.1(C1+)
N$105: C87.1 U$11.1(OUT) U$11.4(-IN)
N$106: U$7.3(+IN) U$8.P$4(OUT)
N$107: C87.2 U$9.3
N$108: C56.1 R97.1 U$11.3(+IN)
N$110: C57.2 IC9.3(C1-)
N$111: C58.1 IC9.4(C2+)
N$112: C58.2 IC9.5(C2-)
N$113: C60.2 IC9.2(V+)
N$114: C59.1 IC9.6(V-)
N$115: IC9.14(T1OUT) X5.3
N$116: IC9.13(R1IN) X5.2
N$117: IC9.7(T2OUT) X5.4
N$118: IC9.8(R2IN) X5.9
N$119: C51.2 R93.1 SO-2.3(+IN)
N$120: C54.1 R95.1 SO-2.5(+IN)
N$121: R96.2 U$7.1(RG1)
N$122: R96.1 U$7.8(RG2)
N$123: R101.1 R103.3(A)
N$124: R102.2 R103.1(E)
N$125: C21.2 IC2.3(CB)
N$126: SG1.2 U$10.2(D)
N$127: R103.2(S) U$7.2(-IN)
N$128: R104.1 U$10.1(G)
N$129: D5.A R105.2
N$130: OK1.1(A) X2.2
N$131: D5.C X2.1
N$132: C55.1 R107.1 U$12.3(OUT)
N$133: LED23.K(C) LED24.A
N$134: LED23.A R109.2
N$135: R114.2 SG1.1
N$136: C63.2 R115.2 R116.1 U$15.1(OUT)
N$137: LED24.K(C) U$13.2(D)
N$138: R108.1 U$13.1(G)
N$139: IC10.5(CV) R110.1
N$140: R117.2 U$7.6(OUT)
N$141: IC10.4(R) R111.1
N$142: C21.1 D3.C IC2.1(VSW) L1.1
N$143: C63.1 D4.C R115.1 U$15.3(+IN)
N$144: IC10.3(Q) R113.2
N$145: C62.2 IC10.2(TR) IC10.6(THR) R112.2
N$146: LED20.2(R:A) R120.2
N$147: C67.2 IC4.1(CB)
N$148: C67.1 D6.C IC4.8(VSW) L3.1
N$149: JP4.6
N$150: C69.2 R119.1 SO-1.5(+IN)
N$151: LED20.1(G:A) R121.2
N$152: C43.2 R84.1 R119.2
N$153: LED21.3(B:A) R125.2
N$154: LED21.2(R:A) R123.2
N$155: LED21.1(G:A) R124.2
N$156: LED22.3(B:A) R128.2
N$157: LED22.2(R:A) R126.2
N$158: LED22.1(G:A) R127.2
N$159: LED25.3(B:A) R131.2
N$160: LED25.2(R:A) R129.2
N$161: LED25.1(G:A) R130.2
N$162: LED26.3(B:A) R134.2
N$163: LED26.2(R:A) R132.2
N$164: LED26.1(G:A) R133.2
N$165: LED27.3(B:A) R137.2
N$166: LED27.2(R:A) R135.2
N$167: LED27.1(G:A) R136.2
N$168: LED28.3(B:A) R140.2
N$169: LED28.2(R:A) R138.2
N$170: LED28.1(G:A) R139.2
N$171: LED29.3(B:A) R143.2
N$172: LED29.2(R:A) R141.2
N$173: LED29.1(G:A) R142.2
N$174: LED30.1(G:A) R145.2
N$175: LED30.2(R:A) R144.2
N$176: LED30.3(B:A) R146.2
N$177: LED31.1(G:A) R148.2
N$178: LED31.2(R:A) R147.2
N$179: LED31.3(B:A) R149.2
N$180: LED32.1(G:A) R151.2
N$181: LED32.2(R:A) R150.2
N$182: LED32.3(B:A) R152.2
N$183: LED33.1(G:A) R154.2
N$184: LED33.2(R:A) R153.2
N$185: LED33.3(B:A) R155.2
N$186: LED34.1(G:A) R157.2
N$187: LED34.2(R:A) R156.2
N$188: LED34.3(B:A) R158.2
N$189: LED35.1(G:A) R160.2
N$190: LED35.2(R:A) R159.2
N$191: LED35.3(B:A) R161.2
N$192: LED36.2(R:A) R162.2
N$193: LED36.3(B:A) R164.2
N$194: LED36.1(G:A) R163.2
N$195: LED37.2(R:A) R165.2
N$196: LED37.3(B:A) R167.2
N$197: LED37.1(G:A) R166.2
N$198: C81.- R168.1
N$199: C80.- R169.1
N$200: J9.3 R168.2
N$201: J9.2 R169.2
N$202: C77.2 R170.2
N$203: C76.2 R171.2
N$204: C78.1 Q4.1 R175.1 U6.3(B:I) U6.6(A:O)
N$205: C79.1 Q4.2 R175.2 U6.1(A:I)
N$206: C73.+ C74.1 C84.1 R176.1 U6.5(P:VCC) U7.12(VCC)
N$207: C85.+ R178.1 U$17.8(VCC)
N$208: C86.+ R179.1 U$22.5(VCC)
N$209: R181.2 U$17.5(ANT)
N$210: R181.1 R182.2 R183.1
N$211: ANT2.1 U$22.16(RFIN)
N$212: ANT1.1 R182.1
PIC32_PGC2: IC1.26(RB6/AN6/PGC2/OCFA) JP4.5
PIC32_PGD2: IC1.27(RB7/AN7/PGD2) JP4.4
PROXIMITY: IC1.50(PMA8/CN18/U2TX/RF5) U$14.OUT
R3: IC6.27(LEDA) R14.2
RED0_00: U$2.6(LED0)
RED0_01: LED5.6(G:C) U$2.7(LED1)
RED0_02: U$2.8(LED2)
RED0_03: U$2.9(LED3)
RED0_04: U$2.10(LED4)
RED0_05: U$2.11(LED5)
RED0_06: U$2.12(LED6)
RED0_07: LED11.6(G:C) U$2.13(LED7)
RED0_08: LED12.4(B:C) U$2.15(LED8)
RED0_09: U$2.16(LED9)
RED0_10: U$2.17(LED10)
RED0_11: U$2.18(LED11)
RED0_12: U$2.19(LED12)
RED0_13: U$2.20(LED13)
RED0_14: U$2.21(LED14)
RED0_15: U$2.22(LED15)
RED1_00: U$19.6(LED0)
RED1_01: LED21.6(G:C) U$19.7(LED1)
RED1_02: U$19.8(LED2)
RED1_03: U$19.9(LED3)
RED1_04: U$19.10(LED4)
RED1_05: U$19.11(LED5)
RED1_06: U$19.12(LED6)
RED1_07: LED29.6(G:C) U$19.13(LED7)
RED1_08: LED30.4(B:C) U$19.15(LED8)
RED1_09: U$19.16(LED9)
RED1_10: U$19.17(LED10)
RED1_11: U$19.18(LED11)
RED1_12: U$19.19(LED12)
RED1_13: U$19.20(LED13)
RED1_14: U$19.21(LED14)
RED1_15: U$19.22(LED15)
RESET_CAN: IC1.94(RE1/PMD1) IC3.17(RESET) R10.1
RESET_ETH: IC1.99(RE3/PMD3) IC6.10(RESET) R23.1
RESET_MIWI: IC1.4(RE6/PMD6) R74.1 U$3.2(/RESET)
RESET_VOLUME: DIL1.11(/RESET) IC1.96(TRD1/RG12) R86.2
RX433_DATA: IC1.79(IC5/PMD12/RD12) U$22.1(DATA)
SCK1: IC1.55(SCK1/INT0/RF6) IC6.8(SCK) U$3.6(SCK)
SCK2: IC1.10(PMA5/CN8/SCK2/RG6) IC3.13(SCK) R172.2 U7.3(BCK)
SCL1: IC1.57(SCL1/RG2) IC7.6(SCL) IC8.6(SCL) R75.1 U$6.2(SCL)
SCL2: IC1.58(RA2/SCL2) R77.1 U$2.26(SCL) U$4.26(SCL) U$5.26(SCL) U$19.26(SCL) U$20.26(SCL) U$21.26(SCL)
SDA1: IC1.56(SDA1/RG3) IC7.5(SDA) IC8.5(SDA) R76.1 U$6.1(SDA)
SDA2: IC1.59(RA3/SDA2) R78.1 U$2.27(SDA) U$4.27(SDA) U$5.27(SDA) U$19.27(SDA) U$20.27(SDA) U$21.27(SDA)
SDI1: IC1.54(SDI1/RF7) IC6.6(SO) U$3.7(SDO)
SDI2: DIL1.2(SCK) IC1.11(PMA4/CN9/SDI2/RG7) IC3.15(SO) U7.1(LRCK)
SDO1: IC1.53(SDO1/RF8) IC6.7(SI) U$3.5(SDI)
SDO2: DIL1.3(SDI) DIL1.13(SDO) IC1.12(PMA3/CN10/SDO2/RG8) IC3.14(SI) R177.1
SIREN: IC1.7(RC2/T3CK) R104.2
TPIN+1: IC6.13(TPIN+) J7.7(RD+) R18.1
TPIN-1: IC6.12(TPIN-) J7.8(RD-) R22.1
TPOUT+1: IC6.17(TPOUT+) J7.1(TD+) R19.2
TPOUT-1: IC6.16(TPOUT-) J7.2(TD-) R20.2
TX433_DATA: IC1.87(PMD11/RF0) U$17.2(DATA)
TX433_LADJ: R180.2 U$17.3(LADJ)
UART_DTR: IC1.97(TRD0/RG13) IC9.10(T2IN)
UART_RI: IC1.23(RB2/AN2/CN4/SS1/C2IN-) IC9.9(R2OUT)
UART_RX: IC1.52(U1RX/RF2) IC9.12(R1OUT)
UART_TX: IC1.51(U1TX/RF3) IC9.11(T1IN)
VCOM: C82.+ U7.7(VCOM)
VDD: C23.1 C50.2 DIL1.14(VDD) IC5.5(VOUT) U$1.8(VDD2) ; supply symbol labelled +3V3
VSS: C23.2 D2.3(A) IC1.15(VSS) IC1.36(VSS) IC1.45(VSS) IC1.65(VSS) IC1.75(VSS) IC5.4(0V) U1.8(RS) U$1.5(GND2) ; supply symbol labelled GND
WAKE_MIWI: IC1.21(RB4/AN4/CN6/C1IN-) R73.1 U$3.3(WAKE)
WOL_ETH: IC1.20(RB5/AN5/CN7/C1IN+) IC6.5(WOL) R17.1
Unconnected: C64.1 IC1.1(RG15) IC1.6(RC1/T2CK) IC1.9(RC4/T5CK) IC1.22(RB3/AN3/CN5/C2IN+) IC1.28(RA9/VR-/PMA7) IC1.29(RA10/VR+/PMA6) IC1.39(U2RTS/BCLK2/RF13) IC1.40(U2CTS/RF12) IC1.41(RB12/AN12/PMA11) IC1.42(RB13/AN13/PMA10) IC1.43(RB14/AN14/PMA1) IC1.44(RB15/AN15/CN12/OCFB/PMA0) IC1.47(U1CTS/CN20/RD14) IC1.48(U1RTS/CN21/BCLK1/RD15) IC1.49(PMA9/CN17/U2RX/RF4) IC1.67(RA15/INT4) IC1.68(IC1/RTCC/RD8) IC1.70(IC3/PMCS2/RD10) IC1.71(IC4/PMCS1/RD11) IC1.82(CN14/PMRD/RD5) IC1.88(PMD10/RF1) IC1.89(PMD9/RG1) IC1.90(PMD8/RG0) IC1.91(RA6/TRCLK) IC1.92(RA7/TRD3) IC1.95(TRD2/RG14) IC2.7(ON) IC3.3(CLKOUT) IC3.4(TX0RTS) IC3.5(TX1RTS) IC3.6(TX2RTS) IC3.10(RX1BF) IC3.11(RX0BF) IC4.2(SS) IC4.3(SYNC) IC4.5(ON) IC6.3(CLKOUT) J2.1 J2.2 J2.3 J2.6 J2.7 J2.8 J7.6(CTR) LED4.4(B:C) LED4.5(R:C) LED4.6(G:C) LED4.TH(TH:TH) LED5.TH(TH:TH) LED6.4(B:C) LED6.5(R:C) LED6.6(G:C) LED6.TH(TH:TH) LED7.4(B:C) LED7.5(R:C) LED7.6(G:C) LED7.TH(TH:TH) LED8.4(B:C) LED8.5(R:C) LED8.6(G:C) LED8.TH(TH:TH) LED9.4(B:C) LED9.5(R:C) LED9.6(G:C) LED9.TH(TH:TH) LED10.4(B:C) LED10.5(R:C) LED10.6(G:C) LED10.TH(TH:TH) LED11.TH(TH:TH) LED12.TH(TH:TH) LED13.4(B:C) LED13.5(R:C) LED13.6(G:C) LED13.TH(TH:TH) LED14.4(B:C) LED14.5(R:C) LED14.6(G:C) LED14.TH(TH:TH) LED15.4(B:C) LED15.5(R:C) LED15.6(G:C) LED15.TH(TH:TH) LED16.4(B:C) LED16.5(R:C) LED16.6(G:C) LED16.TH(TH:TH) LED17.4(B:C) LED17.5(R:C) LED17.6(G:C) LED17.TH(TH:TH) LED18.4(B:C) LED18.5(R:C) LED18.6(G:C) LED18.TH(TH:TH) LED19.4(B:C) LED19.5(R:C) LED19.6(G:C) LED19.TH(TH:TH) LED20.4(B:C) LED20.5(R:C) LED20.6(G:C) LED20.TH(TH:TH) LED21.TH(TH:TH) LED22.4(B:C) LED22.5(R:C) LED22.6(G:C) LED22.TH(TH:TH) LED25.4(B:C) LED25.5(R:C) LED25.6(G:C) LED25.TH(TH:TH) LED26.4(B:C) LED26.5(R:C) LED26.6(G:C) LED26.TH(TH:TH) LED27.4(B:C) LED27.5(R:C) LED27.6(G:C) LED27.TH(TH:TH) LED28.4(B:C) LED28.5(R:C) LED28.6(G:C) LED28.TH(TH:TH) LED29.TH(TH:TH) LED30.TH(TH:TH) LED31.4(B:C) LED31.5(R:C) LED31.6(G:C) LED31.TH(TH:TH) LED32.4(B:C) LED32.5(R:C) LED32.6(G:C) LED32.TH(TH:TH) LED33.4(B:C) LED33.5(R:C) LED33.6(G:C) LED33.TH(TH:TH) LED34.4(B:C) LED34.5(R:C) LED34.6(G:C) LED34.TH(TH:TH) LED35.4(B:C) LED35.5(R:C) LED35.6(G:C) LED35.TH(TH:TH) LED36.4(B:C) LED36.5(R:C) LED36.6(G:C) LED36.TH(TH:TH) LED37.4(B:C) LED37.5(R:C) LED37.6(G:C) LED37.TH(TH:TH) OK1.6(BAS) R16.2 SV1.1 U7.10(AIN) U$3.9(CLKOUT) U$6.3(ALERT) U$22.6(PDN) U$22.7(RSSI) U$22.8(NC3) X5.1 X5.6 X5.7 X5.8

## Notes on the sheet
- Red
- Yellow
- Green
- Init button
- ALPS SKHH
- Horizontal type | fw button
- ALPS SKHH
- Horizontal type | bw button
- ALPS SKHH
- Horizontal type
- CAN Termination
- Alterative for sound output
- If the PIC32 can cope with full 44.1KHz stereo audio streams I will use this circuit instead of PWM
- Remember that CAN i/f has to be moved to SPI1 if used.
- Schema taken from an other open source project at http://www.k9spud.com/traxmod/
- Programming
- Connector
- http://www.vscp.org
- SweetBox  Processor | SweetBox
- http://www.vscp.org
- http://www.vscp.org
- SweetBox
- Copyright (C) 2008 VSCP | 0.0.1
- CAN
- Copyright (C) 2008 VSCP | 0.0.1 | Copyright (C) 2008 VSCP | 0.0.1
- http://www.vscp.org
- http://www.vscp.org
- http://www.vscp.org | SweetBox
- SweetBox | SweetBox
- This part has it's own power module | RGB array 2
- This part has it's own power module | RGB array 1
- Ethernet | Copyright (C) 2008 VSCP | 0.0.1 | 0.0.1
- Copyright (C) 2008 VSCP | 0.0.1
- Copyright (C) 2008 VSCP | 0.0.1
- Not Mounted
- http://www.vscp.org | http://www.vscp.org | http://www.vscp.org
- SweetBox | SweetBox | SweetBox
- MiWi | Serial line | Power
- Copyright (C) 2008 VSCP
- Copyright (C) 2008 VSCP | 0.0.1 | Copyright (C) 2008 VSCP | 0.0.1 | 0.0.1
- Barometer
- Movement Sensor
- Ambient Light Sensor
- 3280 Hz
- 2070 Hz
- Siren
- Humidity Sensor
- Standard PC speakers
- brown
- green | IR Transmitter
- IR Receiver
- 3280 Hz | Standard Alarm Input
- 2070 Hz
- http://www.vscp.org | http://www.vscp.org
- http://www.vscp.org
- SweetBox | SweetBox | SweetBox
- Sound subsystem | SECO devices
- Microphone
- Copyright (C) 2008 VSCP | 0.0.1 | Copyright (C) 2008 VSCP | 0.0.1
- Copyright (C) 2008 VSCP | 0.0.1

## Power pins joined to a net without a drawn wire
+3V3: U1.3(VDD)
VCC: IC9.16(VCC)
VREF: U1.5(VREF)
VSS: IC9.15(GND) U1.2(VSS)

## Library data of the parts
ANT1 ANT2 = discrete:ANTENNA: Antenna
C1-C14 C19 C20 C22 C23 C39-C41 = rcl:C-EU: CAPACITOR, European symbol
C15 C17 C18 C24 C61 C68 C85 C86 = rcl:CPOL-EU: POLARIZED CAPACITOR, European symbol
C16 C21 C67 = cap-master:CNP-: NON-POLARIZED CAP
C25-C29 C31-C38 C42-C60 C63-C66 C69-C72 C87 = Leicester:NP_CAP0805
C30 = Leicester:RSVCAP
C62 = discrete:CAPNP-5
C73 C80-C83 = rcl:CPOL-US: POLARIZED CAPACITOR, American symbol
C74-C79 C84 = rcl:C-US: CAPACITOR, American symbol
D1 D5 = diode:DIODE-: DIODE
D2 = diode:DIODE-2CA|AC: Dual DIODE Cathode-Anode|Anode-Cathode
D3 D6 = diode:SCHOTTKY-DIODE: Schottky Diode
D4 = diode:1N4004: DIODE general purpose rectifier, 1 A
DIL1 = eurosource_mcp42010:MCP42010
IC1 = dodomicro:PIC32MX3X0F*L: PIC32MX GP
IC2 = v-reg-3:LM2676: National Semiconductor <http://www.national.com> 3.0A "Simple Switcher"(c) 260kHz, Vout 1.2-37V, Vin 40V, 150mOhm DMOS switch, 50µA standby current
IC3 = mcp2515:MCP2515
IC4 = v-reg-3:LM2671: National Semiconductor <http://www.national.com> 0.5A "Simple Switcher"(c) 260kHz, Vout 1.2-37V, Vin 40V, 250mOhm DMOS switch, 50µA standby current, optional sync. to 280-400kHz, soft start
IC5 = eurosource_dc-dc:VBT1: http://search.digikey.com/scripts/DkSearch/dksus.dll?Detail?name=102-1397-2-ND
IC6 = microchip-enc28j60:ENC28J60-*: Microchip 10Mbit Eth. contoller with SPI interface
IC7 IC8 = microchip-5:24*: Serial EEPROM I2C
IC9 = maxim:MAX3232*: True RS-232 Transceivers 3.0V to 5.5V, Low-Power up to 1Mbps, Using Four 0.1µF External Capacitors Source: http://pdfserv.maxim-ic.com/en/ds/MAX3222-MAX3241.pdf
IC10 = linear:*555: TIMER
J2 = con-amp:520426-4: AMP connector
J7 = con-pulse:J0026: RJ45 PulseJack w/LEDs
J9 = audiocon:3C-STEREO
JP4 = con-lstb:MA06-1: PIN HEADER
L1 L3 = inductor-coilcraft:DO3316P: COILCRAFT
L2 = rcl:L-US: INDUCTOR, American symbol
LED1-LED3 LED23 LED24 = led:LED: LED OSRAM: - CHIPLED LG R971, LG N971, LY N971, LG Q971, LY Q971, LO R971, LY R971 LH N974, LH R974 LS Q976, LO Q976, LY Q976 LO Q996 - Hyper CHIPLED LW Q18S LB Q993, LB Q99A, LB R99A - SideLED LS A670, LO A670, LY A670, LG A670, LP A670 LB A673, LV A673, LT A673, LW A673 LH A674 LY A675 LS A676, LA A676, LO A676, LY A676, LW A676 LS A679, LY A679, LG A679 - Hyper Micro SIDELED® LS Y876, LA Y876, LO Y876, LY Y876 LT Y87S - SmartLED LW L88C, LW L88S LB L89C, LB L89S, LG L890 LS L89K, LO L89K, LY L89K LS L896, LA L896, LO L896, LY L896 - TOPLED LS T670, LO T670, LY T670, LG T670, LP T670 LSG T670, LSP T670, LSY T670, LOP T670, LYG T670 LG T671, LOG T671, LSG T671 LB T673, LV T673, LT T673, LW T673 LH T674 LS T676, LA T676, LO T676, LY T676, LB T676, LH T676, LSB T676, LW T676 LB T67C, LV T67C, LT T67C, LS T67K, LO T67K, LY T67K, LW E67C LS E67B, LA E67B, LO E67B, LY E67B, LB E67C, LV E67C, LT E67C LW T67C LS T679, LY T679, LG T679 LS T770, LO T770, LY T770, LG T770, LP T770 LB T773, LV T773, LT T773, LW T773 LH T774 LS E675, LA E675, LY E675, LS T675 LS T776, LA T776, LO T776, LY T776, LB T776 LHGB T686 LT T68C, LB T68C - Hyper Mini TOPLED® LB M676 - Mini TOPLED Santana® LG M470 LS M47K, LO M47K, LY M47K Source: http://www.osram.convergy.de - LUMILED® LXK2-PW12-R00, LXK2-PW12-S00, LXK2-PW14-U00, LXK2-PW14-V00 LXK2-PM12-R00, LXK2-PM12-S00, LXK2-PM14-U00 LXK2-PE12-Q00, LXK2-PE12-R00, LXK2-PE12-S00, LXK2-PE14-T00, LXK2-PE14-U00 LXK2-PB12-K00, LXK2-PB12-L00, LXK2-PB12-M00, LXK2-PB14-N00, LXK2-PB14-P00, LXK2-PB14-Q00 LXK2-PR12-L00, LXK2-PR12-M00, LXK2-PR14-Q00, LXK2-PR14-R00 LXK2-PD12-Q00, LXK2-PD12-R00, LXK2-PD12-S00 LXK2-PH12-R00, LXK2-PH12-S00 LXK2-PL12-P00, LXK2-PL12-Q00, LXK2-PL12-R00 Source: www.luxeon.com
LED4-LED22 LED25-LED37 = led:LP2C63-ST-RGB-SR0: 1.5W RGB HIGH POWER LED Source: http://www.ledtech.com.tw .. LP2C63-ST-RGB-SR0.SPEC.pdf
M1 = microphon:ELECTRET_MICROPHON-: Electret Condenser Microphone
OK1 = optocoupler:4N*?M: General Purpose 6-Pin Phototransistor Optocouplers Source: http://www.fairchildsemi.com/ds/4N/4N35-M.pdf
Q1-Q3 Q5 = crystal:CRYSTAL: CRYSTAL
Q4 = crystal:CRYTAL: CRYSTAL
R1-R4 R12-R97 R101 R102 R104-R167 R178-R183 = rcl:R-EU_: RESISTOR, European symbol
R5-R11 R168-R177 = discrete:RESEU-10
R103 = resistor:R-TRIMM: Trimm resistor
S1-S3 = switch-omron:31-XX: OMRON SWITCH
SG1 = buzzer:B/C14S: BUZZER Source: Buerklin
SO-1-SO-3 = eurosource_microchip_opamp:MCP6002
SV1 = con-lstb:MA03-1: PIN HEADER
U1 = microchip_can:MCP2551: High Speed CAN tranceiver
U6 = logic:NC7WZU04: Unbuffered dual inverter tinylogic.
U7 = audio:PCM1770: PCM1770 Texas Instruments/Burr-Brown Stereo DAC with Headphone Amplifier.
U$1 = eurosource_adum120:ADUM1201
U$2 U$4 U$5 U$19-U$21 = eurosource_pca9635:PCA9635
U$3 = eurosource_mrf24j40ma:MRF24J40MA
U$6 = eurosource_mcp9803:MCP9803
U$7 = dallas:INA155
U$8 = dallas:MPXA4115
U$9 = dallas:SJ3523
U$10 U$13 = eurosource_fet:IRFL110
U$11 U$15 U$18 = eurosource_microchip_opamp:MCP6001
U$12 = eurosource_tsop852:TSOP852
U$14 = eurosource_napion:NAPION_14112
U$17 = eurosource_linx:TXM-433-LC
U$22 = eurosource_linx:RXM-433-LR
X1 = con-conrad_bighole:73398?: FEMALE PRINT CONNECTOR Niedervolt-Steckverbinder Distributor Conrad
X2 = con-phoenix-254:MPT2: PHOENIX CONNECTOR
X5 = con-subd:F09: SUB-D